# EAGLE board relay_matrix_16x8 (EAGLE 9.5.1), part 1 of 2
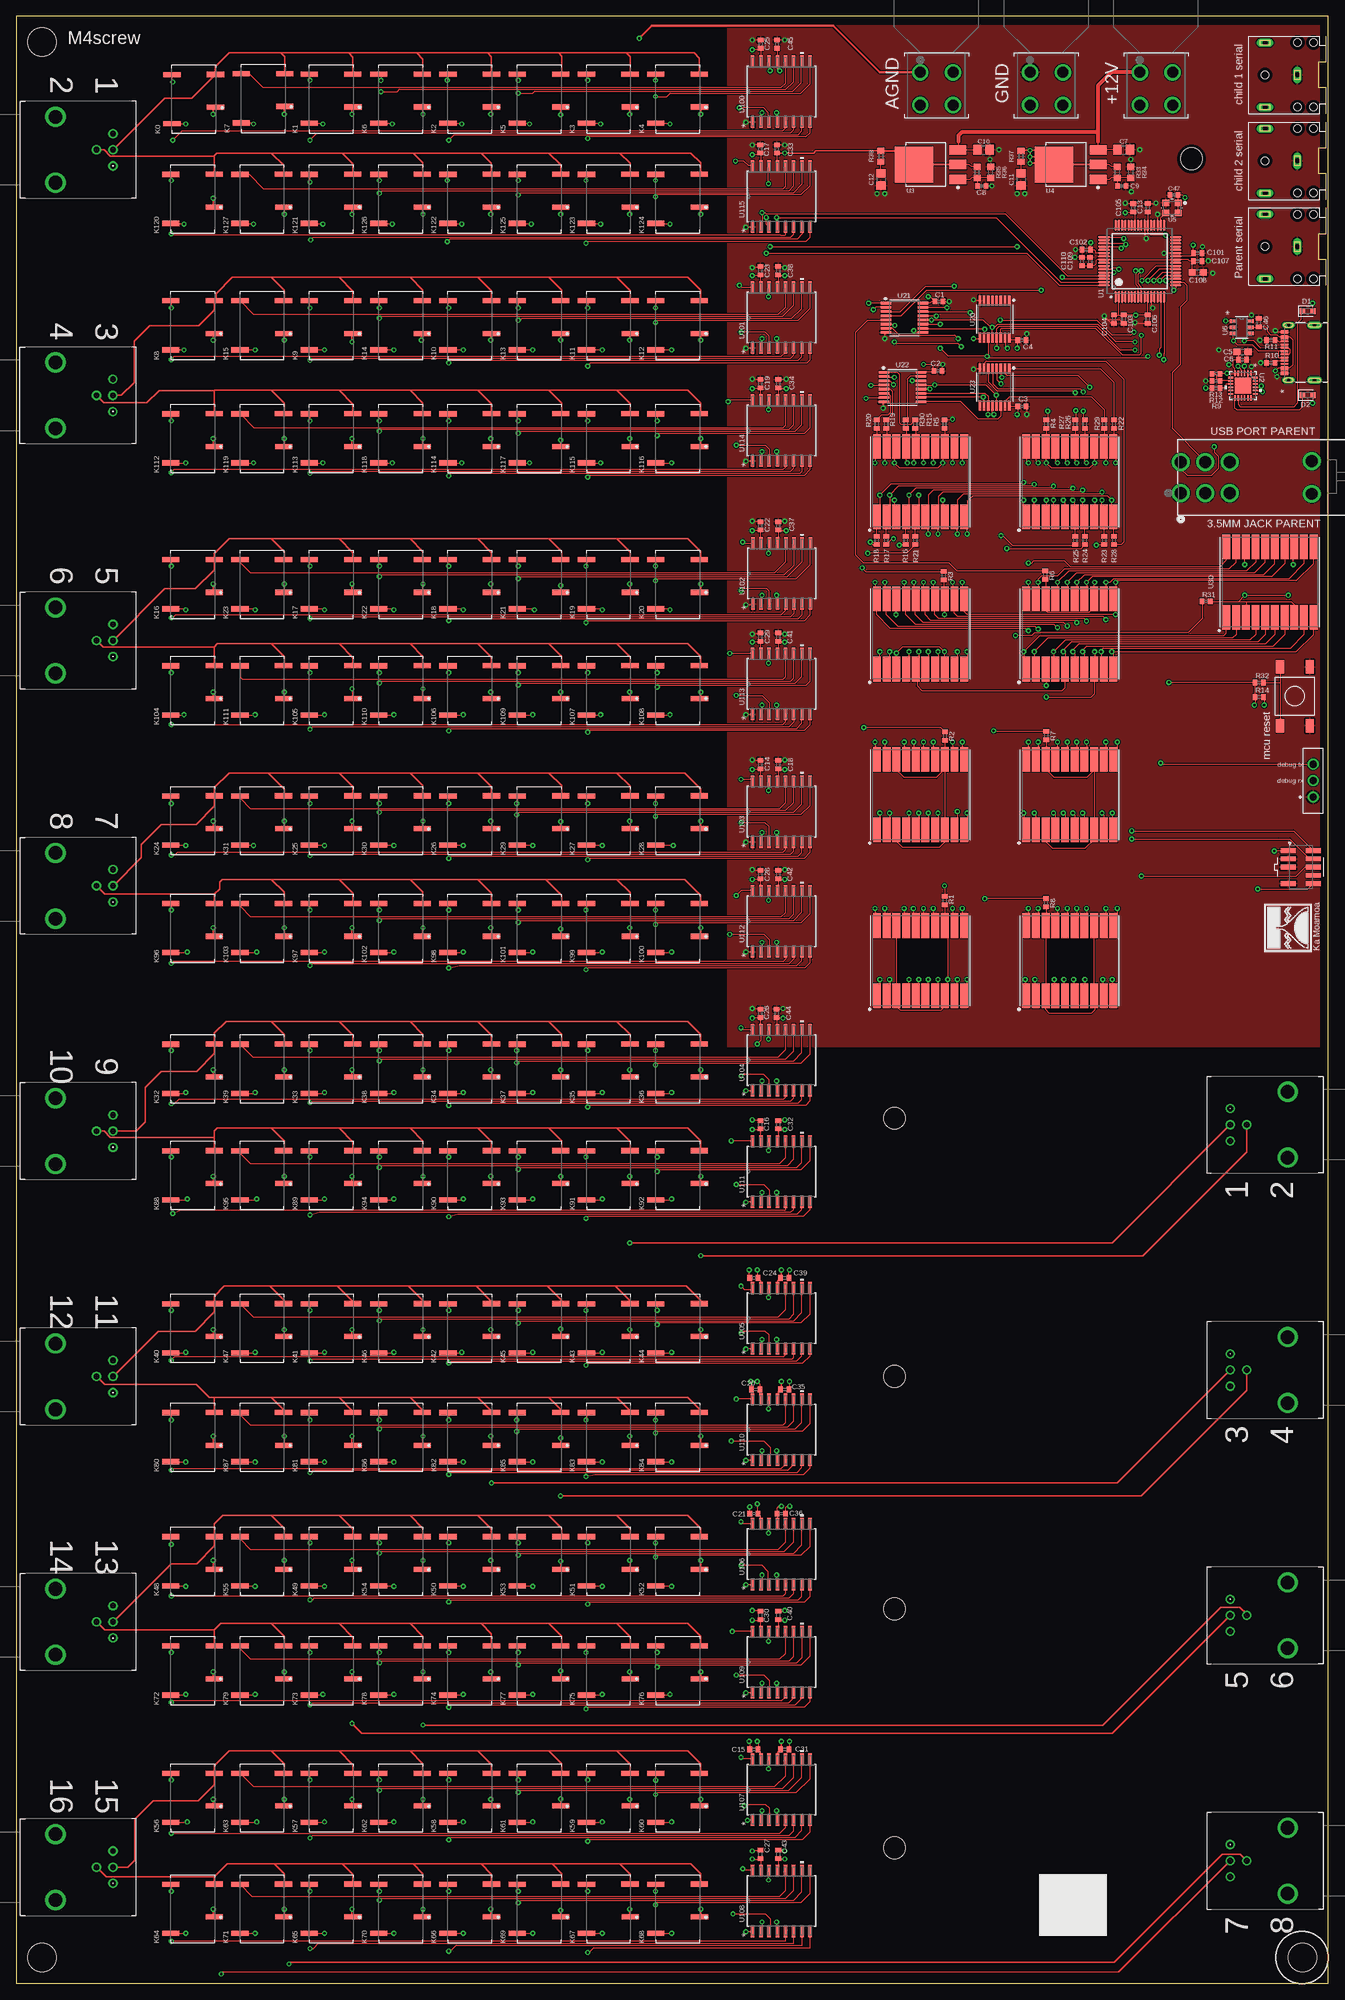
[diagram p7: board, top side]
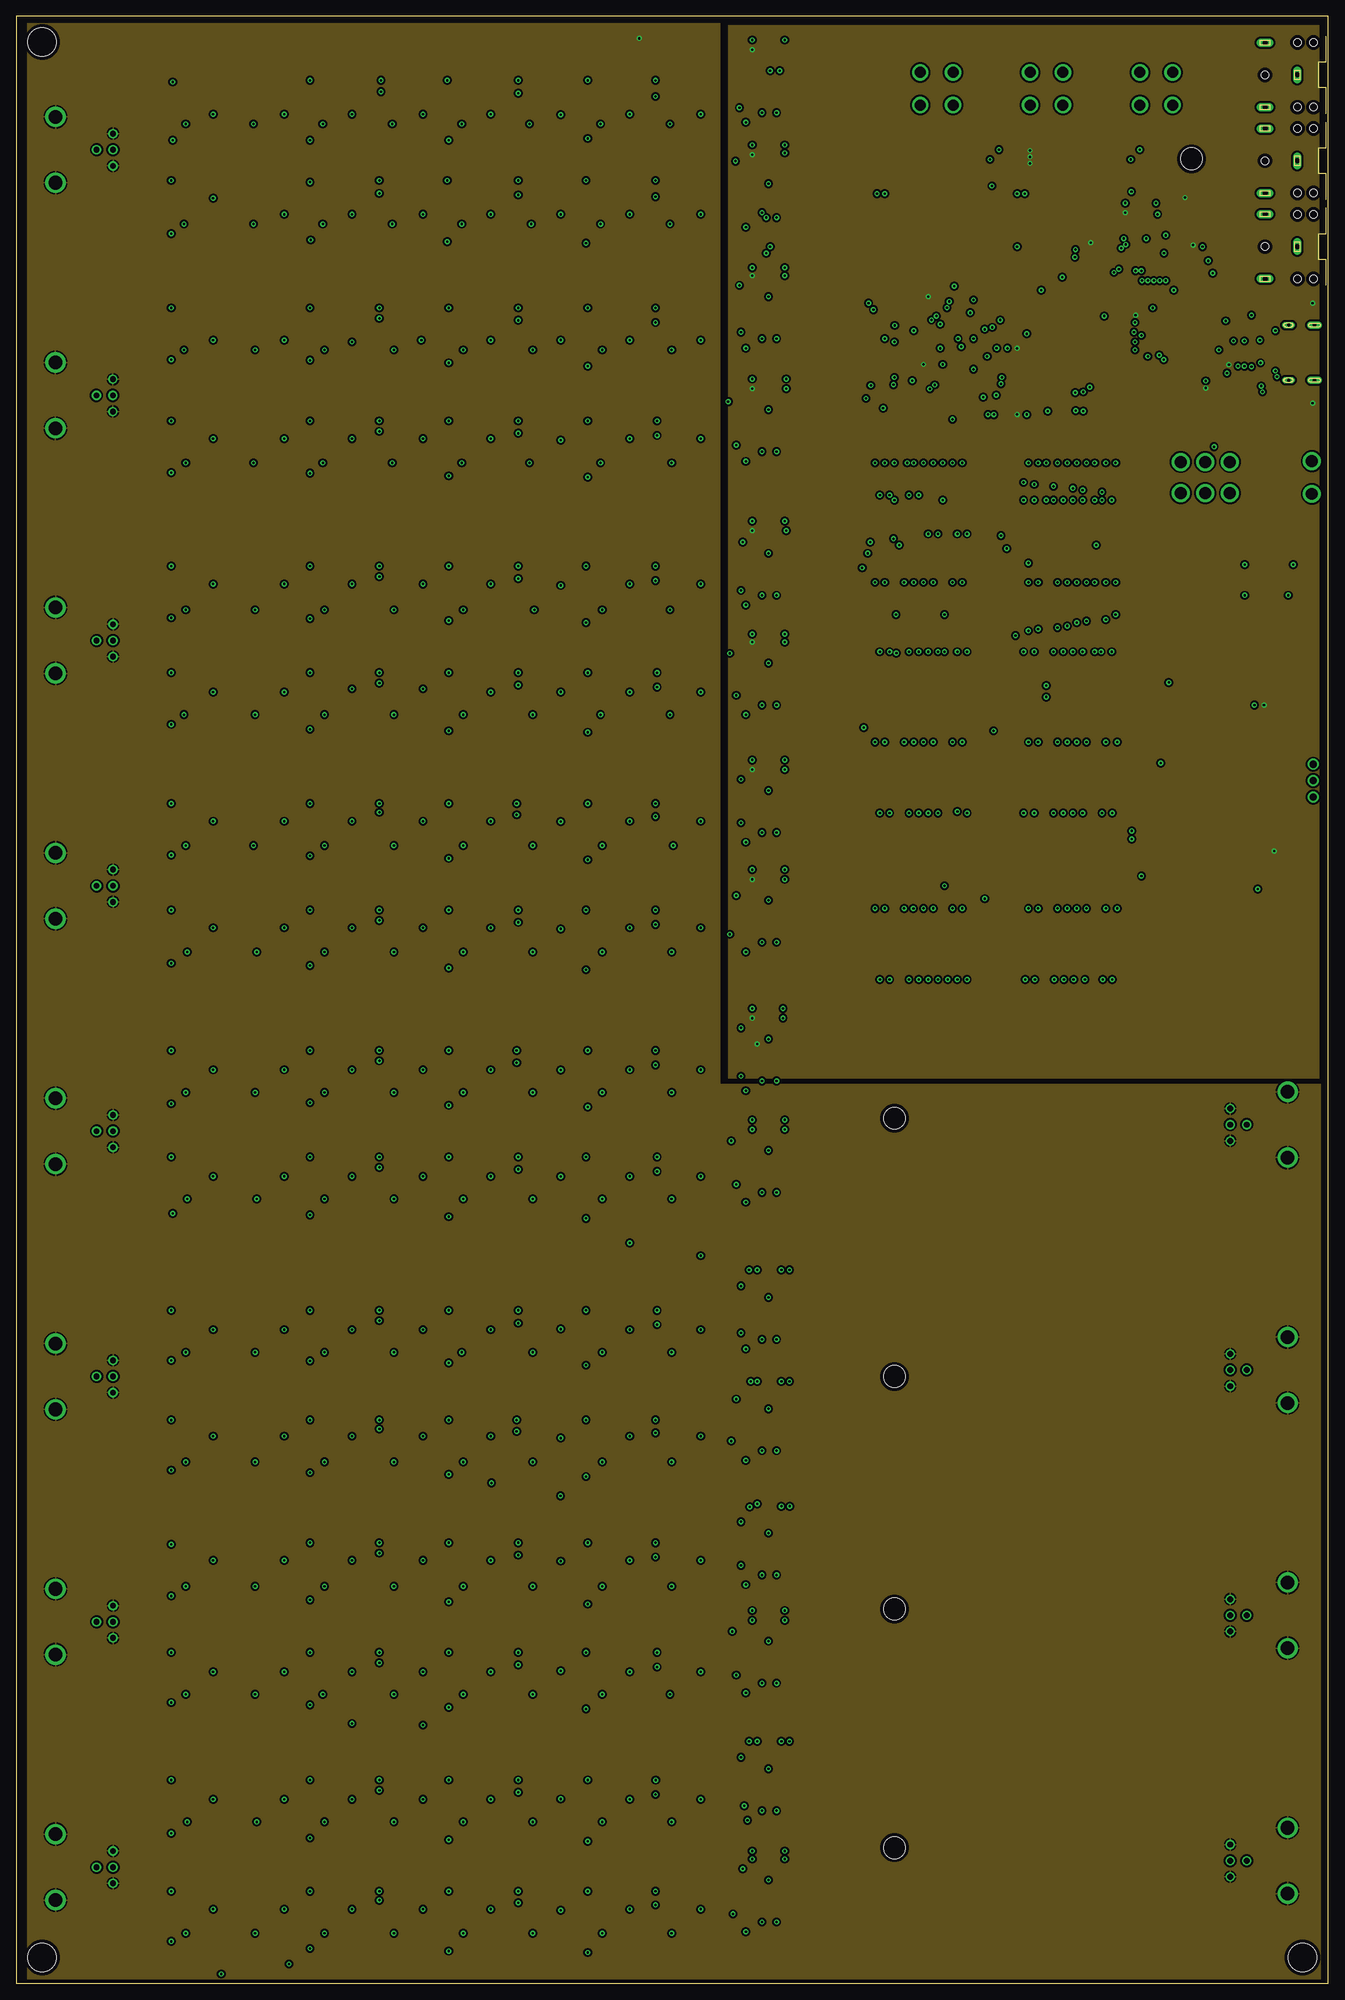
[diagram p8: board, inner layer Route2]
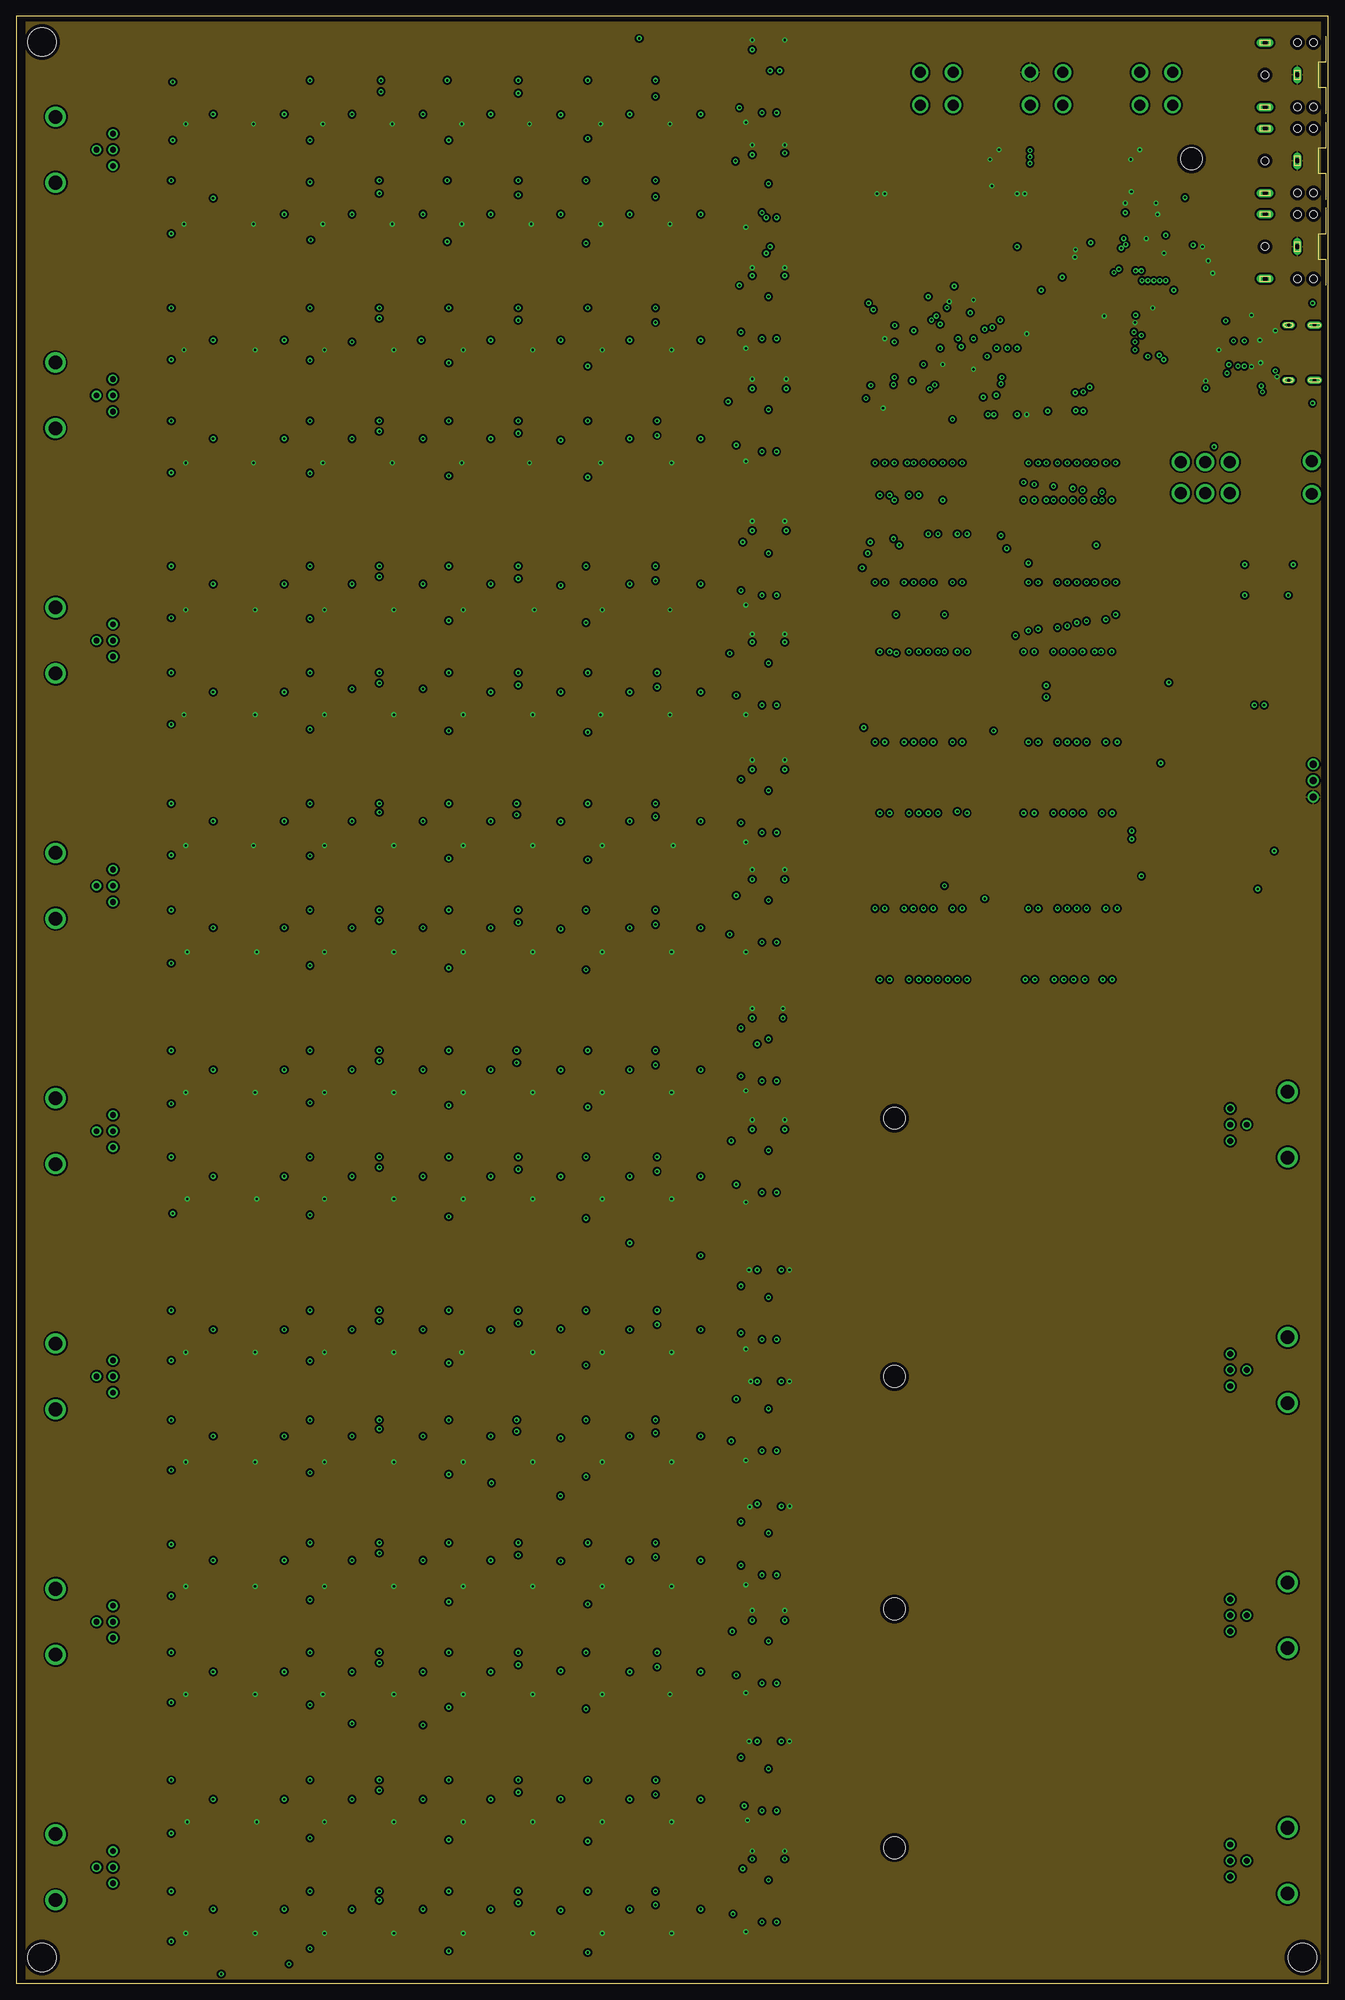
[diagram p9: board, inner layer Route15]
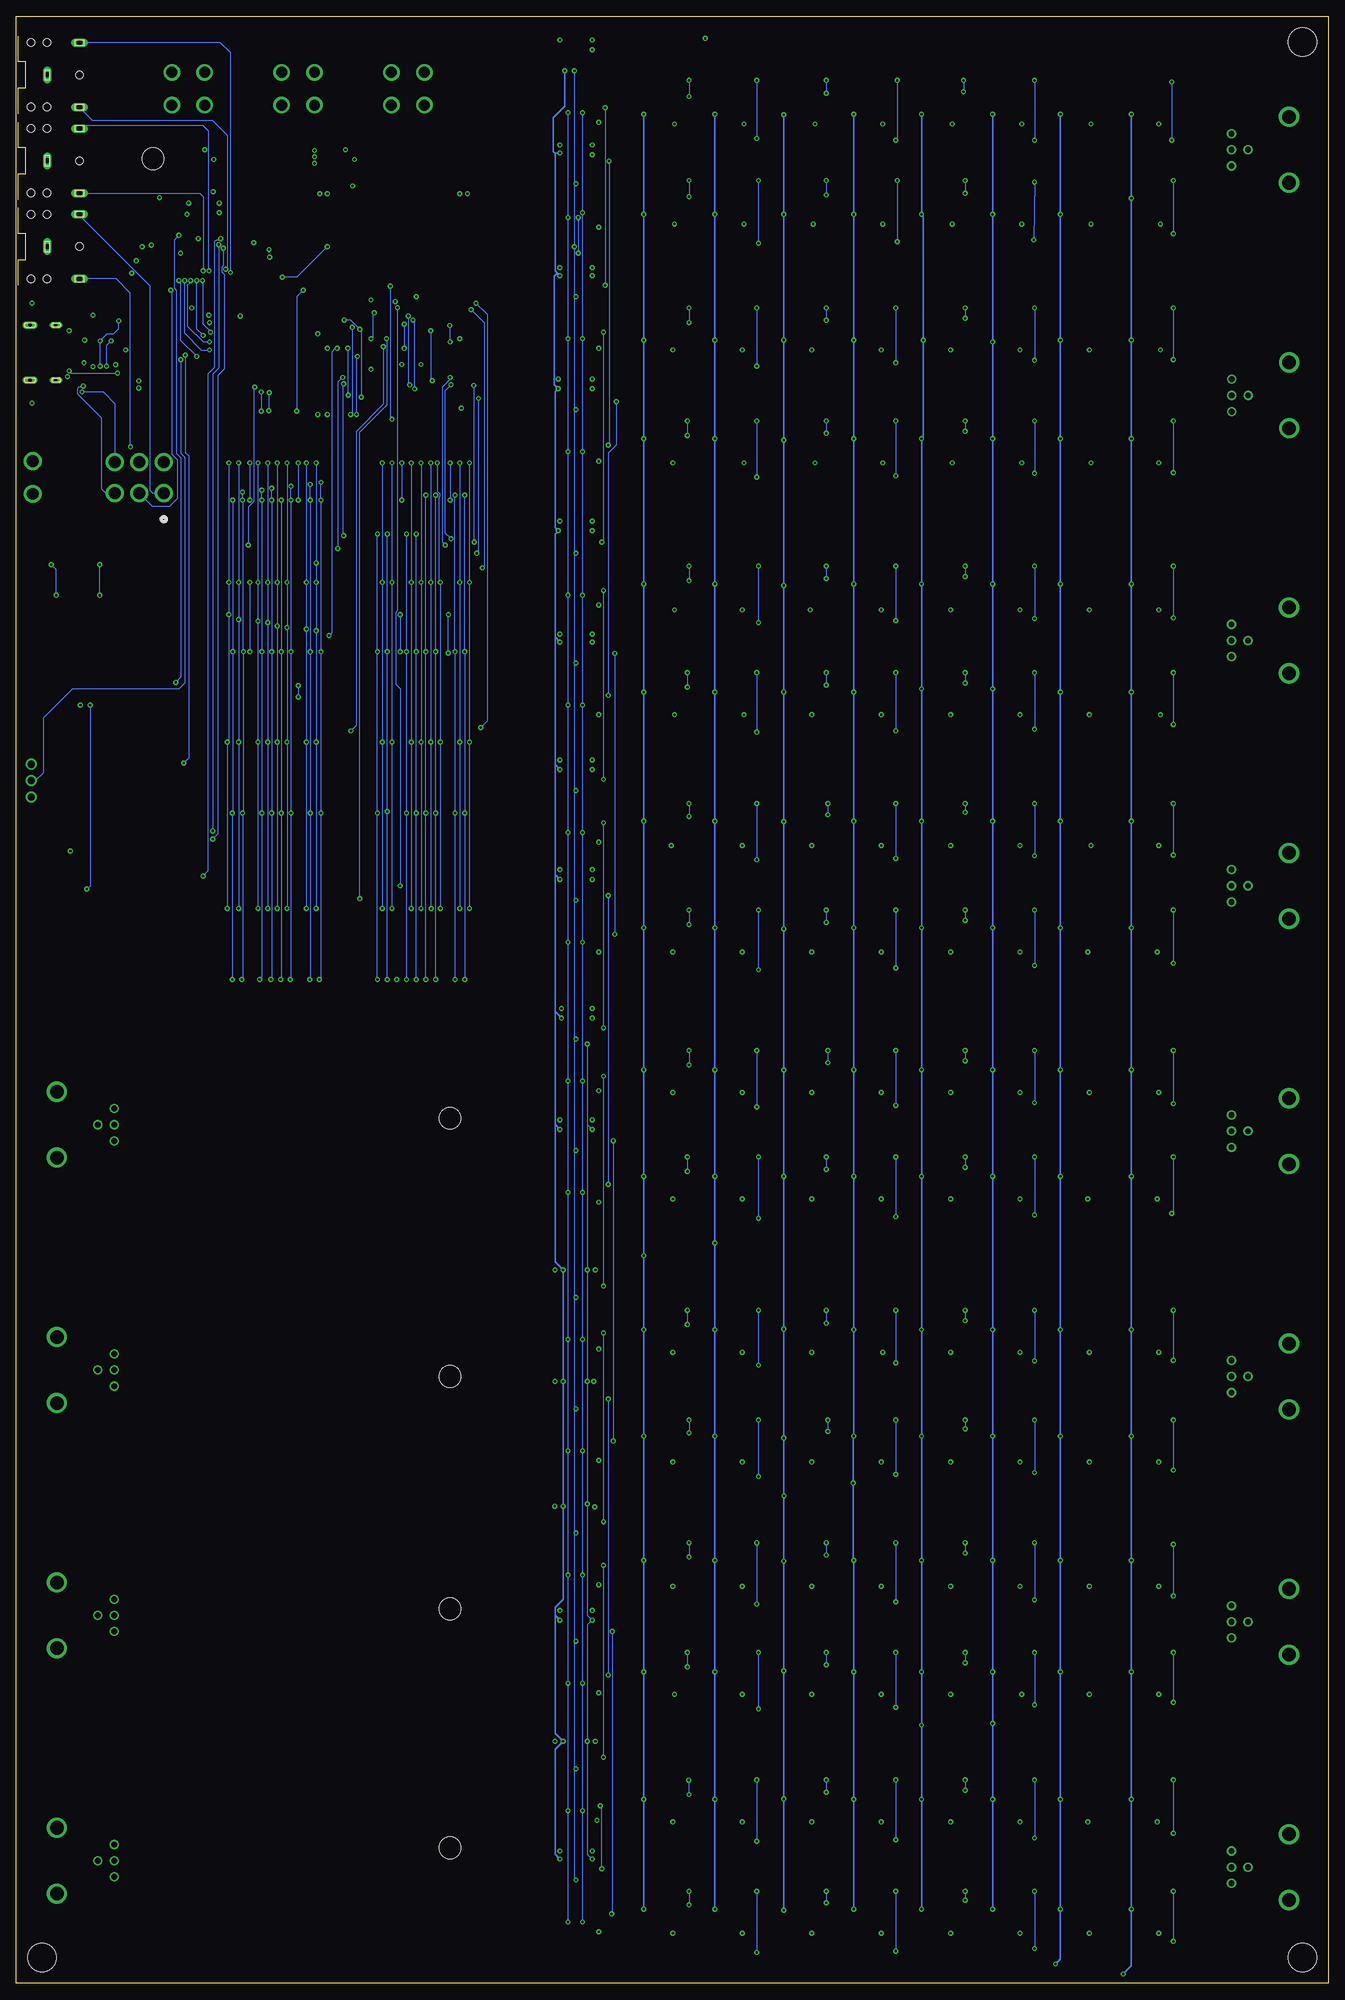
[diagram p10: board, bottom side, seen from below]

Size 203.2 x 304.7 mm. Coordinates in mm from the lower left corner, seen from the top.
Outline: 0,0 203.2,0 203.2,304.7 0,304.7 0,0
Copper layers (1+2*15+16): Top 0.035mm / dielectric 1.5mm / Route2 0.035mm / dielectric 0.15mm / Route15 0.035mm / dielectric 0.2mm / Bottom 0.035mm
Design rules "default *": minimum track width 6mil, minimum drill 0.35mm, track to track 6mil, track to pad 6mil, pad to pad 6mil, via to via 6mil, smd to smd 6mil, copper to edge 20mil, drill to drill 6mil, minimum pad ring 10mil, minimum via ring 8mil, stop-mask expansion 4mil, vias tented up to drill 0mil, thermal gap 10mil
Holes 4.5 mm at 199.2,4 4,4 4,300.7
Holes 3.4 mm at 136,21 136,58 136,94 136,134 182,282.6

## Footprints (pad centres in the part's own frame; a part is rotated, then mirrored left to right if it is on the bottom)
C0402 = smd 0.7 x 0.9: 1 -0.65,0; 2 0.65,0
C0603 = smd 1.1 x 1: 1 -0.85,0; 2 0.85,0
C0805 = smd 1.3 x 1.5: 1 -0.95,0; 2 0.95,0
DIOC1608X70N = smd 0.871 x 0.97: 1 -0.8,0; 2 0.8,0
CONN_CT3151 = drill 1.702 pad 2.21: 1 0,0; 2 5.08,0; 3 0,-5.08; 4 5.08,-5.08
G6L-1F-DC4.5 = smd 0.8 x 2.66: 2 2.54,-6.75; 4 7.62,-6.74; 5 7.6,0; 8 0,0
R0402 = smd 0.7 x 0.9: 1 -0.65,0; 2 0.65,0
R0603 = smd 1 x 1.1: 1 -0.85,0; 2 0.85,0
100DP1T2B4M7QE_EWI = drill 1.854 pad 2.362: 1 0,0; 2 0,-3.81; 3 0,-7.62; 4 4.826,0; 5 4.826,-3.81; 6 4.826,-7.62; 7 -0.127,-20.32; 8 4.953,-20.32
TE_FSMJSMA = smd 1.3 x 2.1: P$1 -2.3,4.55; P$2 -2.3,-4.55; P$3 2.3,4.55; P$4 2.3,-4.55
PM0064A_N = smd 1.8 x 0.3: 1 -5.55,3.75; 2 -5.55,3.25; 3 -5.55,2.75; 4 -5.55,2.25; 5 -5.55,1.75; 6 -5.55,1.25; 7 -5.55,0.75; 8 -5.55,0.25; 9 -5.55,-0.25; 10 -5.55,-0.75; 11 -5.55,-1.25; 12 -5.55,-1.75; 13 -5.55,-2.25; 14 -5.55,-2.75; 15 -5.55,-3.25; 16 -5.55,-3.75; 33 5.55,-3.75; 34 5.55,-3.25; 35 5.55,-2.75; 36 5.55,-2.25; 37 5.55,-1.75; 38 5.55,-1.25; 39 5.55,-0.75; 40 5.55,-0.25; 41 5.55,0.25; 42 5.55,0.75; 43 5.55,1.25; 44 5.55,1.75; 45 5.55,2.25; 46 5.55,2.75; 47 5.55,3.25; 48 5.55,3.75 | smd 0.3 x 1.8: 17 -3.75,-5.55; 18 -3.25,-5.55; 19 -2.75,-5.55; 20 -2.25,-5.55; 21 -1.75,-5.55; 22 -1.25,-5.55; 23 -0.75,-5.55; 24 -0.25,-5.55; 25 0.25,-5.55; 26 0.75,-5.55; 27 1.25,-5.55; 28 1.75,-5.55; 29 2.25,-5.55; 30 2.75,-5.55; 31 3.25,-5.55; 32 3.75,-5.55; 49 3.75,5.55; 50 3.25,5.55; 51 2.75,5.55; 52 2.25,5.55; 53 1.75,5.55; 54 1.25,5.55; 55 0.75,5.55; 56 0.25,5.55; 57 -0.25,5.55; 58 -0.75,5.55; 59 -1.25,5.55; 60 -1.75,5.55; 61 -2.25,5.55; 62 -2.75,5.55; 63 -3.25,5.55; 64 -3.75,5.55
QFN24_SIL = smd 0.813 x 0.254: 1 -1.892,1.25; 2 -1.892,0.75; 3 -1.892,0.25; 4 -1.892,-0.25; 5 -1.892,-0.75; 6 -1.892,-1.25; 13 1.892,-1.25; 14 1.892,-0.75; 15 1.892,-0.25; 16 1.892,0.25; 17 1.892,0.75; 18 1.892,1.25 | smd 0.254 x 0.813: 7 -1.25,-1.892; 8 -0.75,-1.892; 9 -0.25,-1.892; 10 0.25,-1.892; 11 0.75,-1.892; 12 1.25,-1.892; 19 1.25,1.892; 20 0.75,1.892; 21 0.25,1.892; 22 -0.25,1.892; 23 -0.75,1.892; 24 -1.25,1.892 | smd 2.54 x 2.54: 25 0,0
TO230P990X240-4N = smd 2.634 x 1.489: 1 -4.241,2.3; 2 -4.241,0; 3 -4.241,-2.3 | smd 5.934 x 5.527: 4 2.591,0
OSCCC250X200X110N = smd 1.081 x 0.981: 1 -0.966,-0.765; 2 0.966,-0.765; 3 0.966,0.765; 4 -0.966,0.765
DBV6 = smd 0.972 x 0.558: 1 -1.362,0.95; 2 -1.362,0; 3 -1.362,-0.95; 4 1.362,-0.95; 5 1.362,0; 6 1.362,0.95
SOP65P640X120-16N = smd 1.572 x 0.407: 1 -2.872,2.275; 2 -2.872,1.625; 3 -2.872,0.975; 4 -2.872,0.325; 5 -2.872,-0.325; 6 -2.872,-0.975; 7 -2.872,-1.625; 8 -2.872,-2.275; 9 2.872,-2.275; 10 2.872,-1.625; 11 2.872,-0.975; 12 2.872,-0.325; 13 2.872,0.325; 14 2.872,0.975; 15 2.872,1.625; 16 2.872,2.275
LDD-SMHTA304RISITR-20DFN = smd 3.812 x 1.232: 1 -5.45,6.75; 2 -5.45,5.25; 3 -5.45,3.75; 4 -5.45,2.25; 5 -5.45,0.75; 6 -5.45,-0.75; 7 -5.45,-2.25; 8 -5.45,-3.75; 9 -5.45,-5.25; 10 -5.45,-6.75; 11 5.45,-6.75; 12 5.45,-5.25; 13 5.45,-3.75; 14 5.45,-2.25; 15 5.45,-0.75; 16 5.45,0.75; 17 5.45,2.25; 18 5.45,3.75; 19 5.45,5.25; 20 5.45,6.75
SOIC-16_WM_MCH = smd 1.727 x 0.533: 1 -4.75,4.445; 2 -4.75,3.175; 3 -4.75,1.905; 4 -4.75,0.635; 5 -4.75,-0.635; 6 -4.75,-1.905; 7 -4.75,-3.175; 8 -4.75,-4.445; 9 4.75,-4.445; 10 4.75,-3.175; 11 4.75,-1.905; 12 4.75,-0.635; 13 4.75,0.635; 14 4.75,1.905; 15 4.75,3.175; 16 4.75,4.445
HDRV3W64P254_1X3_1016X277X854B = drill 1.105 pad 1.705: 1 0,0; 2 2.54,0; 3 5.08,0
2171790001_MOL = smd 0.61 x 1.143: A1/B12 -3.168,3.303; A4/B9 -2.368,3.303; B1/A12 3.232,3.303; B4/A9 2.432,3.303 | smd 0.305 x 1.143: A5 -1.218,3.303; A6 -0.218,3.303; A7 0.282,3.303; A8 1.282,3.303; B5 1.782,3.303; B6 0.782,3.303; B7 -0.718,3.303; B8 -1.718,3.303 | drill 0.5 pad 1.016 long: P$1 -4.266,2.656; P$2 4.316,2.656 | drill 0.5 pad 1.15 long: P$3 4.316,-1.328; P$4 -4.266,-1.328
FTSH-105-01-F-DV-007-K-P = smd 2.3 x 0.75: P$1 1.95,-2.54; P$2 -1.95,-2.54; P$3 1.95,-1.27; P$4 -1.95,-1.27; P$5 1.95,0; P$6 -1.95,0; P$8 -1.95,1.27; P$9 1.95,2.54; P$10 -1.95,2.54
CUI_SJ1-3523NG = drill 0.8 long: 1 0,0; 2 5,-5; 3 5,5 | hole 1.2: -2.5,5; 0,5; 5,0; -2.5,-5; 0,-5
364A2595 = drill 0.9: 1 0,2.5; 2 0,0; 3 0,-2.5; 4 2.55,0 | drill 2.1: M1 8.9,5.1; M2 8.9,-5.1

## Placement (x,y rotation side)
C1  .1uF  [C0402]  142.91,260.5 0 top
C2  .1uF  [C0402]  142.75,249.75 0 top
C3  .1uF  [C0402]  155.75,244.25 0 top
C4  .1uF  [C0402]  155.75,254.5 0 top
C5  4.7uF  [C0603]  189.9,252.7 0 top
C6  .1uF  [C0402]  189.9,251.5 0 top
C7  10uF  [C0805]  171.5,284 0 top
C8  1uF  [C0402]  149.5,278.4 0 top
C9  1uF  [C0402]  171.2,278.4 0 top
C10  10uF  [C0805]  149.8,284 0 top
C11  10uF  [C0805]  155.6,279.4 270 top
C12  10uF  [C0805]  133.9,279.4 270 top
C13  0.01uF  [C0402]  175.24,275.01 90 top
C14  1uF  [C0402]  115.25,188.75 90 top
C15  1uF  [C0402]  114.25,36.25 180 top
C16  1uF  [C0402]  115.25,133 90 top
C17  1uF  [C0402]  115.24,284.13 90 top
C18  1uF  [C0402]  118,188.75 90 top
C19  1uF  [C0402]  115.25,247.75 90 top
C20  1uF  [C0402]  114.5,92 180 top
C21  1uF  [C0402]  114.25,72.75 180 top
C22  1uF  [C0402]  115.25,225.75 90 top
C23  1uF  [C0402]  115.25,265.25 90 top
C24  1uF  [C0402]  114.25,109.25 180 top
C25  1uF  [C0402]  115.3,300.38 90 top
C26  1uF  [C0402]  115.25,150.25 90 top
C27  1uF  [C0402]  115.25,20 90 top
C28  1uF  [C0402]  115.25,171.75 90 top
C29  1uF  [C0402]  115.25,208.5 90 top
C30  1uF  [C0402]  115.25,57 90 top
C31  1uF  [C0402]  119,36.25 0 top
C32  1uF  [C0402]  118,133 90 top
C33  1uF  [C0402]  117.81,284.13 90 top
C34  1uF  [C0402]  118,247.75 90 top
C35  1uF  [C0402]  119,92 0 top
C36  1uF  [C0402]  118.5,72.75 0 top
C37  1uF  [C0402]  118,225.75 90 top
C38  1uF  [C0402]  117.99,265.25 90 top
C39  1uF  [C0402]  119,109.25 0 top
C40  1uF  [C0402]  118,57 90 top
C41  1uF  [C0402]  118,208.5 90 top
C42  1uF  [C0402]  118,171.75 90 top
C43  1uF  [C0402]  118,20 90 top
C44  1uF  [C0402]  117.75,150.25 90 top
C45  1uF  [C0402]  117.83,300.38 90 top
C46  0.1uF  [C0402]  192.4,257.2 90 top
C47  100n  [C0402]  179.3,277 180 top
C101  0.1uF  [C0402]  183,268 0 top
C102  0.1uF  [C0402]  165.7,268.55 180 top
C103  0.01uF  [C0402]  171.5,257.75 270 top
C104  0.01uF  [C0402]  170,257.75 270 top
C105  1uF  [C0402]  173,275 90 top
C106  0.1uF  [C0402]  175.25,257.75 270 top
C107  0.1uF  [C0402]  183,266.75 0 top
C108  2.2uF  [C0603]  183,265 0 top
C109  0.1uF  [C0402]  166.3,266.7 90 top
C110  1uF  [C0402]  165.05,266.7 90 top
D1  XZCBD53W-8  [DIOC1608X70N]  200,259 0 top
D2  XZCBD53W-8  [DIOC1608X70N]  200,246 0 top
J6  CT3151  [CONN_CT3151]  157,296 0 top
J7  CT3151  [CONN_CT3151]  174,296 0 top
J8  CT3151  [CONN_CT3151]  140,296 0 top
K0  [G6L-1F-DC4.5]  24.13,288.04 90 top
K1  [G6L-1F-DC4.5]  45.4,288.1 90 top
K2  [G6L-1F-DC4.5]  66.87,288.1 90 top
K3  [G6L-1F-DC4.5]  88.33,288.1 90 top
K4  [G6L-1F-DC4.5]  99.06,288.1 90 top
K5  [G6L-1F-DC4.5]  77.6,288.1 90 top
K6  [G6L-1F-DC4.5]  56.13,288.1 90 top
K7  [G6L-1F-DC4.5]  34.86,288.16 90 top
K8  [G6L-1F-DC4.5]  23.94,253 90 top
K9  [G6L-1F-DC4.5]  45.4,253 90 top
K10  [G6L-1F-DC4.5]  66.87,253 90 top
K11  [G6L-1F-DC4.5]  88.33,253 90 top
K12  [G6L-1F-DC4.5]  99.06,253 90 top
K13  [G6L-1F-DC4.5]  77.6,253 90 top
K14  [G6L-1F-DC4.5]  56.13,253 90 top
K15  [G6L-1F-DC4.5]  34.67,253 90 top
K16  [G6L-1F-DC4.5]  23.94,212.9 90 top
K17  [G6L-1F-DC4.5]  45.4,212.9 90 top
K18  [G6L-1F-DC4.5]  66.87,212.9 90 top
K19  [G6L-1F-DC4.5]  88.33,212.9 90 top
K20  [G6L-1F-DC4.5]  99.06,212.9 90 top
K21  [G6L-1F-DC4.5]  77.6,212.9 90 top
K22  [G6L-1F-DC4.5]  56.13,212.9 90 top
K23  [G6L-1F-DC4.5]  34.67,212.9 90 top
K24  [G6L-1F-DC4.5]  23.94,176.31 90 top
K25  [G6L-1F-DC4.5]  45.4,176.31 90 top
K26  [G6L-1F-DC4.5]  66.87,176.31 90 top
K27  [G6L-1F-DC4.5]  88.33,176.31 90 top
K28  [G6L-1F-DC4.5]  99.06,176.31 90 top
K29  [G6L-1F-DC4.5]  77.6,176.31 90 top
K30  [G6L-1F-DC4.5]  56.13,176.31 90 top
K31  [G6L-1F-DC4.5]  34.67,176.31 90 top
K32  [G6L-1F-DC4.5]  23.94,137.86 90 top
K33  [G6L-1F-DC4.5]  45.4,137.86 90 top
K34  [G6L-1F-DC4.5]  66.87,137.86 90 top
K35  [G6L-1F-DC4.5]  88.33,137.86 90 top
K36  [G6L-1F-DC4.5]  99.06,137.86 90 top
K37  [G6L-1F-DC4.5]  77.6,137.86 90 top
K38  [G6L-1F-DC4.5]  56.13,137.86 90 top
K39  [G6L-1F-DC4.5]  34.67,137.86 90 top
K40  [G6L-1F-DC4.5]  23.94,97.66 90 top
K41  [G6L-1F-DC4.5]  45.4,97.66 90 top
K42  [G6L-1F-DC4.5]  66.87,97.66 90 top
K43  [G6L-1F-DC4.5]  88.33,97.66 90 top
K44  [G6L-1F-DC4.5]  99.06,97.66 90 top
K45  [G6L-1F-DC4.5]  77.6,97.66 90 top
K46  [G6L-1F-DC4.5]  56.13,97.66 90 top
K47  [G6L-1F-DC4.5]  34.67,97.66 90 top
K48  [G6L-1F-DC4.5]  23.94,61.59 90 top
K49  [G6L-1F-DC4.5]  45.4,61.59 90 top
K50  [G6L-1F-DC4.5]  66.87,61.59 90 top
K51  [G6L-1F-DC4.5]  88.33,61.59 90 top
K52  [G6L-1F-DC4.5]  99.06,61.59 90 top
K53  [G6L-1F-DC4.5]  77.6,61.59 90 top
K54  [G6L-1F-DC4.5]  56.13,61.59 90 top
K55  [G6L-1F-DC4.5]  34.67,61.59 90 top
K56  [G6L-1F-DC4.5]  23.94,24.94 90 top
K57  [G6L-1F-DC4.5]  45.4,24.94 90 top
K58  [G6L-1F-DC4.5]  66.87,24.94 90 top
K59  [G6L-1F-DC4.5]  88.33,24.94 90 top
K60  [G6L-1F-DC4.5]  99.06,24.94 90 top
K61  [G6L-1F-DC4.5]  77.6,24.94 90 top
K62  [G6L-1F-DC4.5]  56.13,24.94 90 top
K63  [G6L-1F-DC4.5]  34.67,24.94 90 top
K64  [G6L-1F-DC4.5]  23.94,7.75 90 top
K65  [G6L-1F-DC4.5]  45.4,7.75 90 top
K66  [G6L-1F-DC4.5]  66.87,7.75 90 top
K67  [G6L-1F-DC4.5]  88.33,7.75 90 top
K68  [G6L-1F-DC4.5]  99.06,7.75 90 top
K69  [G6L-1F-DC4.5]  77.6,7.75 90 top
K70  [G6L-1F-DC4.5]  56.13,7.75 90 top
K71  [G6L-1F-DC4.5]  34.67,7.75 90 top
K72  [G6L-1F-DC4.5]  23.94,44.65 90 top
K73  [G6L-1F-DC4.5]  45.4,44.65 90 top
K74  [G6L-1F-DC4.5]  66.87,44.65 90 top
K75  [G6L-1F-DC4.5]  88.33,44.65 90 top
K76  [G6L-1F-DC4.5]  99.06,44.65 90 top
K77  [G6L-1F-DC4.5]  77.6,44.65 90 top
K78  [G6L-1F-DC4.5]  56.13,44.65 90 top
K79  [G6L-1F-DC4.5]  34.67,44.65 90 top
K80  [G6L-1F-DC4.5]  23.94,80.8 90 top
K81  [G6L-1F-DC4.5]  45.4,80.8 90 top
K82  [G6L-1F-DC4.5]  66.87,80.8 90 top
K83  [G6L-1F-DC4.5]  88.33,80.8 90 top
K84  [G6L-1F-DC4.5]  99.06,80.8 90 top
K85  [G6L-1F-DC4.5]  77.6,80.8 90 top
K86  [G6L-1F-DC4.5]  56.13,80.8 90 top
K87  [G6L-1F-DC4.5]  34.67,80.8 90 top
K88  [G6L-1F-DC4.5]  23.94,121.35 90 top
K89  [G6L-1F-DC4.5]  45.4,121.35 90 top
K90  [G6L-1F-DC4.5]  66.87,121.35 90 top
K91  [G6L-1F-DC4.5]  88.33,121.35 90 top
K92  [G6L-1F-DC4.5]  99.06,121.35 90 top
K93  [G6L-1F-DC4.5]  77.6,121.35 90 top
K94  [G6L-1F-DC4.5]  56.13,121.35 90 top
K95  [G6L-1F-DC4.5]  34.67,121.35 90 top
K96  [G6L-1F-DC4.5]  23.94,159.65 90 top
K97  [G6L-1F-DC4.5]  45.4,159.65 90 top
K98  [G6L-1F-DC4.5]  66.87,159.65 90 top
K99  [G6L-1F-DC4.5]  88.33,159.65 90 top
K100  [G6L-1F-DC4.5]  99.06,159.65 90 top
K101  [G6L-1F-DC4.5]  77.6,159.65 90 top
K102  [G6L-1F-DC4.5]  56.13,159.65 90 top
K103  [G6L-1F-DC4.5]  34.67,159.65 90 top
K104  [G6L-1F-DC4.5]  23.94,196.47 90 top
K105  [G6L-1F-DC4.5]  45.4,196.47 90 top
K106  [G6L-1F-DC4.5]  66.87,196.47 90 top
K107  [G6L-1F-DC4.5]  88.33,196.47 90 top
K108  [G6L-1F-DC4.5]  99.06,196.47 90 top
K109  [G6L-1F-DC4.5]  77.6,196.47 90 top
K110  [G6L-1F-DC4.5]  56.13,196.47 90 top
K111  [G6L-1F-DC4.5]  34.67,196.47 90 top
K112  [G6L-1F-DC4.5]  23.94,235.49 90 top
K113  [G6L-1F-DC4.5]  45.4,235.49 90 top
K114  [G6L-1F-DC4.5]  66.87,235.49 90 top
K115  [G6L-1F-DC4.5]  88.33,235.49 90 top
K116  [G6L-1F-DC4.5]  99.06,235.49 90 top
K117  [G6L-1F-DC4.5]  77.6,235.49 90 top
K118  [G6L-1F-DC4.5]  56.13,235.49 90 top
K119  [G6L-1F-DC4.5]  34.67,235.49 90 top
K120  [G6L-1F-DC4.5]  23.94,272.59 90 top
K121  [G6L-1F-DC4.5]  45.4,272.59 90 top
K122  [G6L-1F-DC4.5]  66.87,272.59 90 top
K123  [G6L-1F-DC4.5]  88.33,272.59 90 top
K124  [G6L-1F-DC4.5]  99.06,272.59 90 top
K125  [G6L-1F-DC4.5]  77.6,272.59 90 top
K126  [G6L-1F-DC4.5]  56.13,272.59 90 top
K127  [G6L-1F-DC4.5]  34.67,272.59 90 top
R1  [R0402]  143.78,167.7 270 top
R2  [R0402]  143.83,193.21 270 top
R3  [R0402]  143.65,218.04 270 top
R4  [R0402]  159.5,241.5 270 top
R5  [R0402]  143.75,241.5 270 top
R6  [R0402]  159.35,218.11 270 top
R7  [R0402]  159.53,193.27 270 top
R8  [R0402]  159.48,167.38 270 top
R9  1k  [R0402]  185.8,247.1 0 top
R10  5.1k  [R0402]  194.25,251 0 top
R11  5.1k  [R0402]  194.25,254.5 0 top
R12  47.5k  [R0402]  185.8,248.2 0 top
R13  22.1k  [R0402]  185.8,249.3 0 top
R14  10kohm  [R0402]  192.5,199.25 0 top
R15  [R0402]  139.25,241.5 90 top
R16  [R0402]  137.75,223.5 270 top
R17  [R0402]  134.75,223.5 270 top
R18  [R0402]  133.25,223.5 270 top
R19  [R0402]  134.75,241.5 90 top
R20  [R0402]  133.25,241.5 90 top
R21  [R0402]  139.25,223.5 270 top
R22  [R0402]  170,241.5 90 top
R23  [R0402]  168.5,223.5 270 top
R24  [R0402]  165.5,223.5 270 top
R25  [R0402]  164,223.5 270 top
R26  [R0402]  165.5,241.5 90 top
R27  [R0402]  164,241.5 90 top
R28  [R0402]  170,223.5 270 top
R29  [R0402]  168.5,241.5 270 top
R30  [R0402]  137.75,241.5 270 top
R31  [R0402]  184.26,214.05 0 top
R32  470ohm  [R0402]  192.5,201.5 0 top
R33  220  [R0603]  170.5,280.5 90 top
R34  360  [R0603]  172.6,280.5 270 top
R35  220  [R0603]  148.8,280.5 90 top
R36  680  [R0603]  150.9,280.5 270 top
R37  1  [R0603]  155.6,283 90 top
R38  1  [R0603]  133.9,283 90 top
S1  100DP1T2B4M7QE  [100DP1T2B4M7QE_EWI]  180.34,230.83 90 top
S2  [TE_FSMJSMA]  198.01,199.36 0 top
U1  TM4C123GH6PMI  [PM0064A_N]  174,266.75 90 top
U2  CP2102N-A02-GQFN24R  [QFN24_SIL]  189.99,247.47 270 top
U3  NCP1117XXA  [TO230P990X240-4N]  141.6,281.7 180 top
U4  NCP1117XXA  [TO230P990X240-4N]  163.3,281.7 180 top
U5  ECS-2033-080-AU  [OSCCC250X200X110N]  179,275 180 top
U6  [DBV6]  189.8,256.5 0 top
U20  SN74HCS595  [SOP65P640X120-16N]  151.5,257.75 270 top
U21  SN74HCS595  [SOP65P640X120-16N]  137.56,257.96 0 top
U22  SN74HCS595  [SOP65P640X120-16N]  137.25,247.25 0 top
U23  SN74HCS595  [SOP65P640X120-16N]  151.5,247.25 270 top
U30  LDD-SMHTA304RISITR  [LDD-SMHTA304RISITR-20DFN]  194.17,217.04 90 top
U31  LDD-SMHTA304RISITR  [LDD-SMHTA304RISITR-20DFN]  140.05,158.4 90 top
U32  LDD-SMHTA304RISITR  [LDD-SMHTA304RISITR-20DFN]  140.05,184.12 90 top
U33  LDD-SMHTA304RISITR  [LDD-SMHTA304RISITR-20DFN]  140.05,209.02 90 top
U34  LDD-SMHTA304RISITR  [LDD-SMHTA304RISITR-20DFN]  140.05,232.59 90 top
U35  LDD-SMHTA304RISITR  [LDD-SMHTA304RISITR-20DFN]  163.17,232.59 90 top
U36  LDD-SMHTA304RISITR  [LDD-SMHTA304RISITR-20DFN]  163.17,209.02 90 top
U37  LDD-SMHTA304RISITR  [LDD-SMHTA304RISITR-20DFN]  163.17,184.12 90 top
U38  LDD-SMHTA304RISITR  [LDD-SMHTA304RISITR-20DFN]  163.17,158.4 90 top
U100  [SOIC-16_WM_MCH]  118.5,293 90 top
U101  [SOIC-16_WM_MCH]  118.5,258 90 top
U102  [SOIC-16_WM_MCH]  118.55,218.36 90 top
U103  [SOIC-16_WM_MCH]  118.5,181.5 90 top
U104  [SOIC-16_WM_MCH]  118.5,143 90 top
U105  [SOIC-16_WM_MCH]  118.5,103 90 top
U106  [SOIC-16_WM_MCH]  118.5,66.5 90 top
U107  [SOIC-16_WM_MCH]  118.5,30 90 top
U108  [SOIC-16_WM_MCH]  118.5,12.75 90 top
U109  [SOIC-16_WM_MCH]  118.5,49.75 90 top
U110  [SOIC-16_WM_MCH]  118.5,85.75 90 top
U111  [SOIC-16_WM_MCH]  118.5,125.75 90 top
U112  [SOIC-16_WM_MCH]  118.5,164.5 90 top
U113  [SOIC-16_WM_MCH]  118.5,201.25 90 top
U114  [SOIC-16_WM_MCH]  118.5,240.5 90 top
U115  [SOIC-16_WM_MCH]  118.5,276.75 90 top
U$131  3PIN_UART_HEADER  [HDRV3W64P254_1X3_1016X277X854B]  200.84,183.74 90 top
X1  2171790001  [2171790001_MOL]  199.71,252.55 90 top
X2  FTSH-105-01-F-DV-007-K-P  [FTSH-105-01-F-DV-007-K-P]  198.92,172.9 180 top
X3  SJ1-3523NG  [CUI_SJ1-3523NG]  198.4,269 180 top
X4  SJ1-3523NG  [CUI_SJ1-3523NG]  198.4,295.6 180 top
X5  SJ1-3523NG  [CUI_SJ1-3523NG]  198.4,282.3 180 top
X101  364A2595  [364A2595]  15,284 180 top
X102  364A2595  [364A2595]  14.99,245.96 180 top
X103  364A2595  [364A2595]  15,208 180 top
X104  364A2595  [364A2595]  15,170 180 top
X105  364A2595  [364A2595]  15,132 180 top
X106  364A2595  [364A2595]  15,94 180 top
X107  364A2595  [364A2595]  15,56 180 top
X108  364A2595  [364A2595]  15,18 180 top
X111  364A2595  [364A2595]  188,19 0 top
X112  364A2595  [364A2595]  188,57 0 top
X113  364A2595  [364A2595]  188,95 0 top
X114  364A2595  [364A2595]  188,133 0 top

## Tracks (layer width: path | path; a pad name or v marks a point on that pad's centre or on a via)
!RST  (via drill 0.35)
  Top 0.152: 175.25,274.35 C13.1 175.24,272.31 U1.38 175.25,271.2 175.7,270.75 v178,270.75 | v191.75,198 191.85,198.1 R14.1 R32.1 v178.5,201.5 | v192.25,169.5 200.01,169.5 X2.P$10
  Bottom 0.152: v178,270.75 178.75,270 178.75,262.61 178.4,262.26 178.4,237 177.7,236.3 177.7,202.3 v178.5,201.5 | v191.75,198 191.75,170 v192.25,169.5
+5V  (via drill 0.35)
  Top 0.152: C45.1 117.83,297.79 U100.13 | C33.1 117.81,281.56 U115.13 | C43.1 118,17.64 U108.13 | C40.1 118,56.25 118,54.63 U109.13 | C32.1 118,132.25 118,130.63 U111.13 | C44.1 117.75,149.5 117.75,147.87 U104.13 | C42.1 118,171 118,169.38 U112.13 | C18.1 118,188 118,186.38 U103.13 | C41.1 118,207.75 118,206.13 U113.13 | C37.1 118,223.19 U102.13 | C34.1 118,247 118,245.38 U114.13 | C38.1 117.99,264.5 117.99,262.87 U101.13 | C31.1 117.86,35.77 U107.13 | C39.1 118.3,109.2 117.86,108.77 U105.13 | U106.13 117.85,71.27 C36.1 117.85,73.65 118.1,73.9 v118.5,73.9 | U110.13 117.92,90.56 117.92,91.58 C35.1 | 139.3,281.7 139.2,281.6 | R35.2 147.95,281.35 147.6,281.7 U3.2
  Top 0.254: U100.13 117.86,296.63 v118.25,296.25 | C33.1 118.98,283.48 v119,283.5 123.5,283.5 123.85,283.85 R38.2 | v119,264.5 117.99,264.5 | v119.25,247 118,247 | v119.25,225 118.1,225 C37.1 | v119,207.75 118,207.75 | v119,188 118,188 | v119,171 118,171 | v118.75,149.5 117.75,149.5 | v119,132.25 118,132.25 | v118.5,110.5 118.5,109.4 118.3,109.2 | v118.5,93.25 118.5,92.15 C35.1 | v119,56.25 118,56.25 | v118.5,37.5 118.5,36.4 C31.1 | v119,19.25 118.1,19.25 C43.1
  Top 0.305: R38.2 136.95,283.85 139.2,281.6 | U3.2 139.3,281.7
  Top 0.457: U3.4 139.11,281.6 139.2,281.6
  Bottom 0.254: v118.25,296.25 118.25,290.75 120,289 120,283.7 119.75,283.45 | 119.75,283.45 119.75,265.25 119.4,264.9 | v119,207.75 119.75,208.5 | 119.75,208.5 119.75,224.5 v119.25,225 119.75,225.5 119.75,246.5 v119.25,247 119.91,247.66 119.91,264.39 119.4,264.9 | 119.75,208.5 119.75,188.75 | 119.75,188.75 v119,188 | 119.75,188.75 119.75,171.75 | v119,171 119.75,171.75 | 119.75,171.75 119.75,150.5 | v118.75,149.5 119.75,150.5 | 119.75,150.5 119.75,133 | 119.75,133 v119,132.25 | 119.75,133 119.75,111.75 v118.5,110.5 v118.5,93.25 v118.5,73.9 118.5,59.5 119.75,58.25 119.75,57 | v119,56.25 119.75,57 | 119.75,57 119.75,38.75 v118.5,37.5 119.75,36.25 119.75,20 v119,19.25 | v119,283.5 119.7,283.5 119.75,283.45 | 119.4,264.9 v119,264.5
+12V
  Top 0.152: C10.1 U3.3 145.9,284.06 145.9,285.3 | C7.1 U4.3 167.5,284.04 167.5,285.3
  Top 0.61: J7.1 169.6,296 167.5,293.9 167.5,286.7 | 167.5,286.7 167.5,285.3 | 167.5,286.7 146.4,286.7 145.9,286.2 145.9,285.3
AGND  (via drill 0.35)
  Top 0.406: J8.1 133.75,296 126.55,303.2 98.45,303.2 v96.5,301.25
  pour Route2 (isolate 0.305): 1.75,303.5 1.75,0.75 202,0.75 202,139.25 109,139.25 109,303.5
BT1_0  (via drill 0.35)
  Top 0.152: U100.3 116.5,288.35 116.5,289.75 115.75,290.5 v112,290.5 | v112,263 112.25,262.75 U101.16
  Bottom 0.152: v112,290.5 v112,263
BT2_1  (via drill 0.35)
  Top 0.152: U101.3 116.59,255.16 116,255.75 v112.25,255.75 | v112.5,223.25 112.64,223.11 U102.16
  Bottom 0.152: v112.25,255.75 112.25,223.5 v112.5,223.25
BT3_2  (via drill 0.35)
  Top 0.152: U102.3 116.64,215.61 116.25,216 112.5,216 v112.25,215.75 | v112.25,186.5 113.81,186.5 U103.16
  Bottom 0.152: v112.25,215.75 v112.25,186.5
BT4_3  (via drill 0.35)
  Top 0.152: U103.3 116.59,179.16 116,179.75 v112.25,179.75 | v112.25,148 112.5,147.75 U104.16
  Bottom 0.152: v112.25,179.75 v112.25,148
BT5_4  (via drill 0.35)
  Top 0.152: U104.3 116.59,139.91 115.75,140.75 112.5,140.75 v112.25,140.5 | v112.25,108 112.75,107.5 113.81,107.5 U105.16
  Bottom 0.152: v112.25,140.5 v112.25,108
BT6_5  (via drill 0.35)
  Top 0.152: U105.3 116.59,100.41 116,101 112.5,101 v112.25,100.75 | v112.25,71.5 112.5,71.25 U106.16
  Bottom 0.152: v112.25,100.75 v112.25,71.5
BT7_6  (via drill 0.35)
  Top 0.152: U106.3 116.5,61.84 116.5,63.75 115.5,64.75 v112.25,64.75 | v112.25,35 112.5,34.75 U107.16
  Bottom 0.152: v112.25,64.75 v112.25,35
BT8_7  (via drill 0.35)
  Top 0.152: U108.16 112.75,17.5 v112.5,17.75 | v112.75,27.5 113,27.75 116,27.75 116.59,27.16 U107.3
  Bottom 0.152: v112.5,17.75 112.5,27.25 v112.75,27.5
BT9_8  (via drill 0.35)
  Top 0.152: U109.16 v110.89,54.5 | v110.89,54.5 | v111,10.75 116,10.75 116.75,10 116.75,8.15 U108.3
  Bottom 0.152: v110.89,54.5 110.89,10.86 v111,10.75
BT10_9  (via drill 0.35)
  Top 0.152: U110.16 v111.5,90.5 | v111.5,90.5 | v111.5,47.75 115.75,47.75 116.59,46.91 U109.3
  Bottom 0.152: v111.5,90.5 v111.5,47.75
BT11_10  (via drill 0.35)
  Top 0.152: U111.16 v110.75,130.5 | v110.75,130.5 | v110.75,84 115.75,84 116.75,83 116.75,81.16 U110.3
  Bottom 0.152: v110.75,130.5 v110.75,84
BT12_11  (via drill 0.35)
  Top 0.152: U112.16 112.25,169.25 v111.5,168.5 | v111.5,123.75 115.75,123.75 116.59,122.91 U111.3
  Bottom 0.152: v111.5,168.5 v111.5,123.75
BT13_12  (via drill 0.35)
  Top 0.152: U113.16 v110.5,206 | v110.5,206 | v110.5,162.5 115.75,162.5 116.59,161.66 U112.3
  Bottom 0.152: v110.5,206 v110.5,162.5
BT14_13  (via drill 0.35)
  Top 0.152: U114.16 110.5,245.25 v110.25,245 | v111.5,199.5 115.5,199.5 116.59,198.41 U113.3
  Bottom 0.152: v110.25,245 110.25,238.25 111.5,237 v111.5,199.5
BT15_14  (via drill 0.35)
  Top 0.152: U115.16 113.45,281.5 112.7,282.25 v111.39,282.25 | v111.5,238.25 116,238.25 116.59,237.66 U114.3
  Bottom 0.152: v111.39,282.25 111.39,238.36 v111.5,238.25
D1A  (via drill 0.35)
  Top 0.152: R30.2 137.8,240.8 U34.17 137.8,238 137.8,236.8 137.8,235.7 v138,235.5 | U35.17 160.92,235.83 v161.25,235.5 | U36.17 161.25,214.8 v161.25,217 163.08,218.83 190.58,218.83 192,220.25 192,222.41 U30.17 | v161.25,192.25 161.25,189.9 U37.17 | v161.25,166.5 161.25,164.18 U38.17 | v161.25,210 160.77,210.48 139.27,210.48 137.75,212 137.75,214.41 | 137.75,214.41 U33.17 | 137.75,214.41 137.5,214.66 v137.5,217 | v137.5,192.25 137.5,189.87 U32.17 | v137.5,166.5 137.5,164.15 U31.17
  Bottom 0.152: v161.25,235.5 v161.25,217 v161.25,210 v161.25,192.25 v161.25,166.5 | v137.5,166.5 v137.5,192.25 v137.5,217 137.75,217.25 137.75,230.14 137.64,230.25 137.64,230.75 138,231.11 v138,235.5
D1B  (via drill 0.35)
  Top 0.152: R15.1 139.3,240.8 U34.16 139.3,236.8 139,236.5 v139,235.5 | U35.16 162.42,235.83 v162.75,235.5 | U36.16 162.75,214.8 v162.75,217 164.27,218.52 191.77,218.52 193.42,220.17 U30.16 | v162.75,192.25 162.75,189.9 U37.16 | v162.75,166.5 162.75,164.18 U38.16 | v162.75,210.25 162.22,210.78 140.47,210.78 139.25,212 139.25,214.41 | 139.25,214.41 U33.16 | v139,217 139,214.66 139.25,214.41 | U32.16 139,189.87 v139,192.25 | v138.94,166.5 138.94,165.44 138.75,165.25 138.75,164.4 U31.16
  Bottom 0.152: v162.75,235.5 v162.75,217 v162.75,210.25 v162.75,192.25 v162.75,166.5 | v139,235.5 v139,217 v139,192.25 139,166.56 v138.94,166.5
D1C  (via drill 0.35)
  Top 0.152: R16.1 137.75,227.09 U34.4 138.25,227.59 v138.25,230.5 139.33,231.58 160.34,231.58 v160.64,231.88 | U35.4 160.64,227.41 v160.64,229.75 | U36.4 160.64,203.84 v160.64,206.25 162.5,208.11 191.11,208.11 192,209 192,211.51 U30.4 | v160.64,181.25 160.92,180.98 U37.4 | v160.75,155.5 160.75,153.11 U38.4 | U31.4 137.8,153.3 138.25,153.75 v138.25,155.5 | v138.25,181.25 138.25,179.12 U32.4 | v138.25,206.25 138.25,204.01 U33.4
  Bottom 0.152: v160.75,155.5 160.64,155.61 v160.64,181.25 v160.64,206.25 v160.64,229.75 v160.64,231.88 | v138.25,155.5 v138.25,181.25 v138.25,206.25 v138.25,230.5
D1D  (via drill 0.35)
  Top 0.152: R17.1 134.75,227.09 U34.2 135.25,227.59 v135.25,230.5 136.63,231.88 157.34,231.88 v157.64,232.18 | U35.2 157.64,227.41 v157.64,229.75 | U36.2 157.64,203.84 v157.64,206.25 159.81,208.41 188.41,208.41 189,209 189,211.51 U30.2 | v157.64,181.25 157.92,180.98 U37.2 | v157.75,155.5 157.75,153.11 U38.2 | U33.2 134.8,204.3 135.25,204.75 v135.25,206.25 | v135.25,181.25 135.25,179.12 U32.2 | v135.25,155.5 135.25,153.39 U31.2
  Bottom 0.152: v157.75,155.5 157.64,155.61 v157.64,181.25 v157.64,206.25 v157.64,229.75 v157.64,232.18 | v135.25,230.5 v135.25,206.25 v135.25,181.25 v135.25,155.5
D1DP  (via drill 0.35)
  Top 0.152: R21.1 139.25,227.09 U34.5 139.75,227.59 v139.75,230.5 | v162.14,229.75 162.42,229.48 U35.5 162.25,226.97 | v162.14,181.25 162.42,180.98 U37.5 | v162.25,155.5 162.25,153.11 U38.5 | U31.5 139.3,153.8 139.75,154.25 v139.75,155.5 | v139.75,181.25 139.75,179.12 U32.5 | v139.75,206.25 139.75,204.01 U33.5 139.5,203.37 139.5,201 140.25,200.25 162,200.25 162.42,200.67 U36.5 162.42,205.98 v162.14,206.25 162.14,206.5 163.45,207.81 192.31,207.81 193.5,209 193.5,211.51 U30.5
  Bottom 0.152: v162.14,229.75 v162.14,206.25 v162.14,181.25 162.14,155.61 v162.25,155.5 | v139.75,155.5 v139.75,181.25 v139.75,206.25 v139.75,230.5
D1E  (via drill 0.35)
  Top 0.152: R18.1 133.25,227.09 U34.1 133.75,227.59 v133.75,230.5 135.44,232.19 155.7,232.19 v156,232.49 | U35.1 156,227.56 v156,229.75 | U36.1 156,203.99 v156,206.25 158.5,208.75 187,208.75 187.42,209.17 U30.1 | v156,181.25 156,179.09 U37.1 | v156.25,155.5 156.25,153.11 U38.1 | U33.1 133.3,204.55 133.75,205 v133.75,206.25 | v133.75,181.25 133.75,179.12 U32.1 | v133.75,155.5 133.75,153.39 U31.1
  Bottom 0.152: v156.25,155.5 156,155.75 v156,181.25 v156,206.25 v156,229.75 v156,232.49 | v133.75,230.5 v133.75,206.25 v133.75,181.25 v133.75,155.5
D1F  (via drill 0.35)
  Top 0.152: R19.1 134.8,240.8 U34.19 134.8,237.05 134.5,236.75 v134.5,235.5 | U35.19 157.92,235.83 v158.25,235.5 | U36.19 158.25,214.8 v158.25,217 158.25,217.5 158.79,218.04 161.29,218.04 162.38,219.13 187.88,219.13 188.92,220.17 U30.19 | v158.25,192.25 158.25,189.9 U37.19 | v158.25,166.5 158.25,164.18 U38.19 | v158.25,209.75 157.83,210.17 136.58,210.17 134.75,212 134.75,214.41 U33.19 134.5,214.77 v134.5,217 | v134.5,192.25 134.5,190.25 134.25,190 134.68,189.57 U32.19 | v134.5,166.5 134.5,164.15 U31.19
  Bottom 0.152: v158.25,235.5 v158.25,217 v158.25,209.75 v158.25,192.25 v158.25,166.5 | v134.5,235.5 v134.5,217 v134.5,192.25 v134.5,166.5
D1G  (via drill 0.35)
  Top 0.152: R20.1 133.3,240.8 U34.20 133.3,236.8 133,236.5 v133,235.5 | U35.20 156.42,235.83 v156.75,235.5 | v156.75,217 156.75,214.8 U36.20 | v156.75,192.25 156.75,189.9 U37.20 | v156.75,166.5 156.75,164.18 U38.20 | v156.75,209.5 156.38,209.87 135.38,209.87 133.25,212 133.25,214.41 | 133.25,214.41 U33.20 | v133,217 133,214.66 133.25,214.41 | v133,192.25 133,189.87 U32.20 | v133,166.5 133,165.5 132.75,165.25 132.75,164.4 U31.20 | v156.75,220 157.25,220 157.61,220.36 162.32,220.36 163.25,219.44 186.44,219.44 187.42,220.42 U30.20
  Bottom 0.152: v156.75,235.5 v156.75,220 v156.75,217 v156.75,209.5 v156.75,192.25 v156.75,166.5 | v133,235.5 v133,217 v133,192.25 v133,166.5
D1HI  (via drill 0.35)
  Top 0.152: U21.15 144.11,259.59 v144.15,259.55 | v143.75,170 143.78,169.97 R1.1
  Bottom 0.152: v144.15,259.55 144.15,212.6 144.44,212.31 144.44,201.25 143.75,200.56 v143.75,170
D1PWR  (via drill 0.35)
  Top 0.152: R1.2 143.78,163.87 U31.13 144.25,163.4 v144.25,155.5 144.25,155.25 144.25,154.25 143.8,153.8 U31.8 143.8,151.3 143.25,150.75 136.91,150.75 136.5,151.16 136.5,152.75 U31.3 U31.18
D2A  (via drill 0.35)
  Top 0.152: R29.2 168.5,238.12 U35.12 168.75,237.71 v168.75,235.5 | U36.12 168.75,214.8 v168.75,217 169.39,217 170,217.61 197.11,217.61 199.5,220 199.5,222.41 U30.12 | v168.75,192.25 168.75,189.9 U37.12 | v168.75,166.5 168.75,164.18 U38.12 | v168.75,211.25 168.31,211.69 145.81,211.69 145.25,212.25 145.25,214.25 | 145.25,214.25 145.25,214.41 U33.12 | U34.12 145.3,237.05 145,236.75 v145,235.5 | v145,217 145,214.5 145.25,214.25 | U32.12 145,189.87 v145,192.25 | v145,166.5 145,164.15 U31.12
  Bottom 0.152: v168.75,235.5 v168.75,217 v168.75,211.25 v168.75,192.25 v168.75,166.5 | v145,235.5 v145,217 v145,192.25 v145,166.5
D2B  (via drill 0.35)
  Top 0.152: R22.1 170,238.12 U35.11 170.25,237.71 v170.25,235.5 | v170.5,192.25 170.5,190.15 U37.11 | v170.5,166.5 170.5,164.43 U38.11 | U36.11 169.92,214.72 170.25,215.05 v170.25,217 170.5,217.25 198.25,217.25 200.92,219.92 U30.11 | v170.25,212 147.25,212 146.8,212.45 U33.11 146.5,214.77 v146.5,217 | U34.11 146.8,236.8 146.5,236.5 v146.5,235.5 | v146.5,192.25 146.5,189.87 U32.11 | v146.5,166.5 146.5,164.15 U31.11
  Bottom 0.152: v170.5,166.5 v170.5,192.25 170.25,192.5 v170.25,212 v170.25,217 v170.25,235.5 | v146.5,235.5 v146.5,217 v146.5,192.25 v146.5,166.5
D2C  (via drill 0.35)
  Top 0.152: R23.1 168.5,227.06 U35.9 168.14,227.41 v168.14,229.75 | U36.9 168,203.99 v168,206.25 168,206.5 168.36,206.86 197.36,206.86 199.5,209 199.5,211.51 U30.9 | v168.14,181.25 168.42,180.98 U37.9 | v168.25,155.5 168.25,153.11 U38.9 | v168.14,230.96 167.84,230.66 146.66,230.66 145.75,229.75 145.75,227.59 145.46,227.29 | U34.9 145.46,227.29 | U31.9 145.3,153.8 145.75,154.25 v145.75,155.5 | U32.9 145.32,178.68 145.75,179.12 v145.75,181.5 | v145.75,206.25 145.75,204.01 U33.9 | v145.75,224.5 145.75,227 145.46,227.29
  Bottom 0.152: v168.25,155.5 168.14,155.61 v168.14,181.25 168,181.39 v168,206.25 168.14,206.39 v168.14,229.75 v168.14,230.96 | v145.75,155.5 v145.75,181.5 v145.75,206.25 v145.75,224.5
D2D  (via drill 0.35)
  Top 0.152: R24.1 165.5,227.06 U35.7 165.14,227.41 v165.14,229.75 | U36.7 165.42,205.98 v165.14,206.25 165.14,206.5 165.81,207.16 194.66,207.16 196.5,209 196.5,211.51 U30.7 | v165.14,181.25 165.42,180.98 U37.7 | v165.5,155.5 165.5,153.03 U38.7 | v165.14,231.27 164.84,230.97 143.47,230.97 142.75,230.25 142.75,227.59 U34.7 142.75,226.69 v142.75,224.5 | U31.7 142.3,153.8 142.75,154.25 v142.75,155.5 | v142.75,181.25 142.75,179.12 U32.7 | v142.75,206.25 142.75,204.01 U33.7
  Bottom 0.152: v165.5,155.5 165.14,155.86 v165.14,181.25 v165.14,206.25 v165.14,229.75 v165.14,231.27 | v142.75,155.5 v142.75,181.25 v142.75,206.25 v142.75,224.5
D2DP  (via drill 0.35)
  Top 0.152: R28.1 170,227.06 U35.10 169.64,227.41 v169.64,229.75 169.04,230.36 148.11,230.36 147.3,229.55 147.3,227.64 146.96,227.29 | U36.10 169.92,205.98 v169.64,206.25 198.25,206.25 200.92,208.92 U30.10 | v169.75,181.25 169.75,178.84 U37.10 | v169.75,155.5 169.75,153.11 U38.10 | 146.96,227.29 U34.10 | U31.10 146.8,153.55 147.25,154 v147.25,155.5 | v147.25,181.25 147.25,179.12 U32.10 | v147.25,206.25 147.25,204.01 U33.10 | v147.25,224.5 147.25,227 146.96,227.29
  Bottom 0.152: v169.64,229.75 v169.64,206.25 169.64,181.36 v169.75,181.25 v169.75,155.5 | v147.25,155.5 v147.25,181.25 v147.25,206.25 v147.25,224.5
D2E  (via drill 0.35)
  Top 0.152: R25.1 164,227.06 U35.6 163.92,229.48 v163.64,229.75 | U36.6 163.92,205.98 v163.64,206.25 163.64,206.5 164.64,207.5 193.5,207.5 195,209 195,211.51 U30.6 | v163.64,181.25 163.92,180.98 U37.6 | v163.75,155.5 163.75,153.11 U38.6 | v163.64,231.57 163.34,231.27 142.02,231.27 141.25,230.5 141.25,227.59 U34.6 141.25,226.69 v141.25,224.5 | U31.6 140.8,154.05 141.25,154.5 v141.25,155.5 | v141.25,181.25 141.25,179.12 U32.6 | v141.25,206.25 141.25,204.01 U33.6
  Bottom 0.152: v163.75,155.5 163.64,155.61 v163.64,181.25 v163.64,206.25 v163.64,229.75 v163.64,231.57 | v141.25,155.5 v141.25,181.25 v141.25,206.25 v141.25,224.5
D2F  (via drill 0.35)
  Top 0.152: R26.1 165.5,238.12 U35.14 165.42,235.83 v165.75,235.5 | U36.14 165.75,214.8 v165.75,217 166.66,217.91 194.41,217.91 196.5,220 196.5,222.41 U30.14 | v165.75,192.25 165.75,189.9 U37.14 | v165.75,166.5 165.75,164.18 U38.14 | v165.75,211 165.36,211.39 142.86,211.39 142.25,212 142.25,214.25 | U33.14 142.25,214.41 142.25,214.25 | U34.14 142.3,236.8 142,236.5 v142,235.5 | v142,217 142,214.5 142.25,214.25 | v142,192.25 142,189.87 U32.14 | v142,166.5 142,164.75 141.75,164.5 141.75,164.4 U31.14
  Bottom 0.152: v165.75,235.5 v165.75,217 v165.75,211 v165.75,192.25 v165.75,166.5 | v142,235.5 v142,217 v142,192.25 v142,166.5
D2G  (via drill 0.35)
  Top 0.152: R27.1 164,238.12 U35.15 163.92,235.83 v164.25,235.5 | U36.15 164.25,214.8 v164.25,217 165.47,218.22 193.22,218.22 194.92,219.92 U30.15 | v164.25,192.25 164.25,189.9 U37.15 | v164.25,166.5 164.25,164.18 U38.15 | v164.25,210.75 163.91,211.09 141.66,211.09 140.75,212 140.75,214.41 U33.15 140.5,214.77 v140.5,217 | U34.15 140.8,237.3 140.5,237 v140.5,235.5 | v140.5,192.25 140.5,189.87 U32.15 | v140.5,166.5 140.5,164.15 U31.15
  Bottom 0.152: v164.25,235.5 v164.25,217 v164.25,210.75 v164.25,192.25 v164.25,166.5 | v140.5,235.5 v140.5,217 v140.5,192.25 v140.5,166.5
D2HI  (via drill 0.35)
  Top 0.152: R2.1 143.19,194.5 v131.25,194.5 | U21.1 132.01,260.24 v132,260.25
  Bottom 0.152: v132,260.25 130.25,258.5 130.25,195.5 v131.25,194.5
D2PWR
  Top 0.152: R2.2 143.83,189.6 U32.13 | U32.13 U32.8 143.8,176.8 143,176 137.25,176 136.3,176.95 U32.3 | U32.13 143.8,188.05 142.5,186.75 137.5,186.75 136,188.25 136,189.27 U32.18
D3HI  (via drill 0.35)
  Top 0.152: U21.2 133.09,259.59 v132.75,259.25 | v131,219.25 131.56,218.69 R3.1
  Bottom 0.152: v132.75,259.25 130.75,257.25 130.75,219.5 v131,219.25
D3PWR  (via drill 0.35)
  Top 0.152: R3.2 143.65,214.62 U33.13 143.8,212.05 v143.75,212 | U33.8 143.75,203.62 v143.75,206.25 143,207 137.25,207 v136.3,206.05 U33.3 | v136.25,212 136.25,214.41 U33.18
  Bottom 0.152: v143.75,212 v143.75,206.25 | v136.3,206.05 136.3,211.95 v136.25,212
D4HI  (via drill 0.35)
  Top 0.152: U21.3 136.94,258.94 140.86,262.86 v145.25,262.86 | v145,242.25 144.9,242.15 R5.1
  Bottom 0.152: v145.25,262.86 145.25,242.5 v145,242.25
D4PWR  (via drill 0.35)
  Top 0.152: R5.2 143.8,240.8 U34.13 143.8,236.8 143.5,236.5 v143.5,235.5 142.75,234.75 136.75,234.75 v136,235.5 136,236.5 136.3,236.8 U34.18 | v143.5,229.75 143.5,227.44 U34.8 | v136,229.75 136,227.44 U34.3
  Bottom 0.152: v143.5,235.5 v143.5,229.75 | v136,235.5 v136,229.75
D5HI  (via drill 0.35)
  Top 0.152: U21.4 137.04,258.29 141,262.25 v158.75,262.25 | v159.75,243.5 159.75,242.4 R4.1
  Bottom 0.152: v158.75,262.25 159.75,261.25 v159.75,243.5
D5PWR  (via drill 0.35)
  Top 0.152: R4.2 159.5,238.12 U35.18 159.42,235.58 v159.5,235.5 160.25,234.75 166.25,234.75 v167,235.5 166.92,235.58 U35.13 | v167,229.75 167,227.22 U35.8 | v159.5,229.75 159.5,227.22 U35.3
  Bottom 0.152: v167,235.5 v167,229.75 | v159.5,235.5 v159.5,229.75
D6HI
  Top 0.152: R6.1 145.74,218.76 144.5,220 131.25,220 130,221.25 130,255.75 131.89,257.64 U21.5
D6PWR  (via drill 0.35)
  Top 0.152: R6.2 159.42,217.4 U36.18 159.42,212.64 159.75,212.31 166.1,212.31 166.5,212.71 166.5,214.05 U36.13 166.92,216.92 v167,217 | v167,206.25 167,203.65 | 167,203.65 U36.8 | U36.3 159.5,203.49 v159.5,201 | v159.5,199.25 166.5,199.25 167,199.75 167,203.65
  Bottom 0.152: v167,217 v167,206.25 | v159.5,201 v159.5,199.25
D7HI  (via drill 0.35)
  Top 0.152: U21.6 135.87,256.99 v136.05,256.8 | v146.36,253.5 145.86,254 136.25,254 v136,254.25 | v151.36,194 159.45,194 R7.1
  Bottom 0.152: v136.05,256.8 136.05,254.3 v136,254.25 | v146.36,253.5 146.36,244.57 150.56,240.38 150.56,194.8 v151.36,194
D7PWR
  Top 0.152: R7.2 159.53,189.68 U37.18 159.25,189.4 159.25,188.25 160.75,186.75 165.75,186.75 166.92,187.92 U37.13 U37.8 166.92,177.17 165.5,175.75 160.5,175.75 159.25,177 159.25,178.5 U37.3
D8HI  (via drill 0.35)
  Top 0.152: R8.1 150.03,168.03 v150,168 | v145.86,254.75 145.36,255.25 136.75,255.25 135.66,256.34 U21.7
  Bottom 0.152: v150,168 150,240.25 145.75,244.5 145.75,254.75 v145.86,254.75
D8PWR
  Top 0.152: R8.2 159.48,163.91 U38.18 U38.3 159.42,150.83 160,150.25 166.5,150.25 167,150.75 167,151.5 166.92,151.58 U38.8 U38.13
DISP_CLK  (via drill 0.35)
  Top 0.152: U20.11 150.53,252.17 v150.36,252 | v150.5,243 150.5,244.35 | 150.5,244.35 U23.11 | U22.11 140.15,246.3 150,246.3 150.5,245.8 150.5,244.35 | U21.11 143.1,256.99 v143.11,257 | v150.36,252 144.36,252 v143.11,253.25 | v178,263.75 178.25,264 U1.19 | v175.25,252 175,251.75 150.61,251.75 v150.36,252
  Bottom 0.152: v150.36,252 150.5,251.86 v150.5,243 | v143.11,257 v143.11,253.25 | v178,263.75 177.8,263.55 177.8,254.55 v175.25,252
DISP_SER  (via drill 0.35)
  Top 0.152: v175.25,263.75 177,265.5 U1.22 | U20.14 152.47,256.23 152.64,256.39 167.11,256.39 171.25,252.25 174,252.25 174.25,252.5 v174.25,255.25
  Bottom 0.152: v174.25,255.25 175.25,256.25 v175.25,263.75
DISP_STRB  (via drill 0.35)
  Top 0.152: U20.12 151.18,256.48 v151.16,256.5 | v151.41,243 151.18,243.23 U23.12 | v151.16,256.5 150.91,256.5 149.77,257.64 v141.75,257.64 U21.12 | U22.12 141.46,246.93 v141.5,246.97 | v176.18,263.75 176.23,263.75 177.48,265 U1.21 | v151.16,256.5 151.5,256.5 152,257 167.5,257 170.25,254.25 v173.25,254.25
  Bottom 0.152: v151.41,243 151.16,243.25 151.16,246.07 v151.16,256.5 | v141.5,246.97 141.5,257.39 v141.75,257.64 | v176.18,263.75 176.18,263.5 176.68,263 176.68,256.68 174.25,254.25 v173.25,254.25
DISP_~OE  (via drill 0.35)
  Top 0.152: v151.82,253.28 U20.13 151.82,256.27 152.25,256.69 167.31,256.69 171,253 v173.25,253 | U23.13 151.77,244.44 v151.77,246 150.19,247.57 v142.25,247.57 U22.13 | v142.5,258.25 140.47,258.25 U21.13 | U1.20 177.84,264.5 v177.09,263.75
  Bottom 0.152: v142.25,247.57 142.5,247.82 v142.5,258.25 | v177.09,263.75 177.2,263.64 177.2,255.7 174.5,253 v173.25,253 | v151.77,246 151.77,253.22 v151.82,253.28
DISP_~SRCLR  (via drill 0.35)
  Top 0.152: U20.10 149.88,256.07 v150,256.19 140.58,256.19 U21.10 | U23.10 149.75,244.5 v149.75,245.69 140.19,245.69 U22.10 | U1.23 176.5,266 174.34,263.84 v174.34,263.75 | v152.38,257.63 167.37,257.63 169.75,255.25 172.61,255.25 v173.11,255.75
  Bottom 0.152: v149.75,245.69 149.75,255.94 v150,256.19 150,256.25 151.38,257.63 v152.38,257.63 | v174.34,263.75 174.34,257.09 173,255.75 v173.11,255.75
DRIV_CLK  (via drill 0.35)
  Top 0.152: U100.2 115.33,289.57 v115.5,289.75 | U115.2 115.5,272.18 v115.5,274.25 115.96,274.25 116.11,274.11 153.14,274.11 162.75,264.5 U1.61 | v115.5,254.75 115.5,253.43 U101.2 | v115.5,237.25 115.5,235.93 U114.2 | v115.5,215 115.5,213.74 U102.2 | v115.5,198 115.5,196.68 U113.2 | v115.5,178.25 115.5,176.93 U103.2 | v115.5,161.25 115.5,159.93 U112.2 | v115.5,139.75 115.5,138.43 U104.2 | v115.5,122.5 115.5,121.17 U111.2 | v115.5,99.75 115.5,98.42 U105.2 | v115.5,82.5 115.5,81.17 U110.2 | v115.5,63.25 115.5,61.92 U106.2 | v115.5,46.5 115.5,45.17 U109.2 | v115.5,26.75 115.5,25.43 U107.2 | v115.5,9.5 115.5,8.18 U108.2 | U1.61
  Bottom 0.152: v115.5,289.75 v115.5,274.25 v115.5,254.75 v115.5,237.25 v115.5,215 v115.5,198 v115.5,178.25 v115.5,161.25 v115.5,139.75 v115.5,122.5 v115.5,99.75 v115.5,82.5 v115.5,63.25 v115.5,46.5 v115.5,26.75 v115.5,9.5
DRIV_DATA  (via drill 0.35)
  Top 0.152: U115.3 116.14,272.45 v116.14,273.5 | v116.14,268 156.5,268 161.5,263 U1.64
  Bottom 0.152: v116.14,273.5 v116.14,268
DRIV_EN  (via drill 0.35)
  Top 0.152: U100.14 116.59,296.4 v116.75,296.25 | v116.5,278.75 116.5,281.4 U115.14 | v116.5,261.25 116.59,261.35 U101.14 | v116.5,243.75 116.5,245.16 U114.14 | v116.5,221.5 116.5,222.97 U102.14 | v116.5,204.5 116.5,205.91 U113.14 | v116.5,184.75 116.5,186.16 U103.14 | v116.5,167.75 116.5,169.16 U112.14 | v116.5,146.25 116.5,147.66 U104.14 | v116.5,129 116.5,130.41 U111.14 | v116.5,106.25 116.5,107.66 U105.14 | v116.5,89 116.5,90.41 U110.14 | v116.5,69.75 116.5,71.16 U106.14 | v116.5,53 116.5,54.41 U109.14 | v116.5,33.25 116.5,34.66 U107.14 | v116.5,16 116.5,17.41 U108.14 | v116.75,269 v155,269 | v162,264.25 162.25,264 U1.62
  Bottom 0.152: v116.75,296.25 116.75,279 v116.5,278.75 116.75,278.5 v116.75,269 116.75,261.5 v116.5,261.25 116.75,261 116.75,244 v116.5,243.75 116.75,243.5 116.75,221.75 v116.5,221.5 116.75,221.25 116.75,204.75 v116.5,204.5 116.75,204.25 116.75,185 v116.5,184.75 116.75,184.5 116.75,168 v116.5,167.75 116.75,167.5 116.75,146.5 v116.5,146.25 116.75,146 116.75,129.25 v116.5,129 116.75,128.75 116.75,106.5 v116.5,106.25 116.75,106 116.75,89.25 v116.5,89 116.75,88.75 116.75,70 v116.5,69.75 116.75,69.5 116.75,53.25 v116.5,53 116.75,52.75 116.75,33.5 v116.5,33.25 116.75,33 116.75,16.25 v116.5,16 | v155,269 159.75,264.25 v162,264.25
DRIV_STRB  (via drill 0.35)
  Top 0.152: U100.4 117.86,289.63 v117.75,289.75 | U115.4 117.75,272.12 v117.75,273.5 151.75,273.5 161.75,263.5 U1.63 | v117.75,254.75 117.75,253.37 U101.4 | v117.75,237.25 117.75,235.87 U114.4 | v117.75,215 117.75,213.77 U102.4 | v117.75,198 117.75,196.62 U113.4 | v117.75,178.25 117.75,176.87 U103.4 | v117.75,161.25 117.75,159.87 U112.4 | v117.75,139.75 117.75,138.37 U104.4 | v117.75,122.5 117.75,121.11 U111.4 | v117.75,99.75 117.75,98.36 U105.4 | v117.75,82.5 117.75,81.11 U110.4 | v117.75,63.25 117.75,61.87 U106.4 | v117.75,46.5 117.75,45.12 U109.4 | v117.75,26.75 117.75,25.36 U107.4 | v117.75,9.5 117.75,8.12 U108.4
  Bottom 0.152: v117.75,289.75 v117.75,273.5 v117.75,254.75 v117.75,237.25 v117.75,215 v117.75,198 v117.75,178.25 v117.75,161.25 v117.75,139.75 v117.75,122.5 v117.75,99.75 v117.75,82.5 v117.75,63.25 v117.75,46.5 v117.75,26.75 v117.75,9.5
GND  (via drill 0.35)
  Top 0.152: K64.8 v26.25,7.75 | K71.8 v36.99,7.75 v37,7.75 | K65.8 v47.74,7.75 v47.75,7.75 | K70.8 v58.49,7.75 v58.5,7.75 | K66.8 v69.25,7.75 | K69.8 v80,7.75 | K67.8 v90.75,7.75 | K68.8 v101.5,7.75 | K60.8 101.44,24.94 v101.5,25 | K59.8 90.69,24.94 v90.75,25 | K61.8 79.94,24.94 v80,25 | K58.8 69.19,24.94 v69.25,25 | K62.8 58.44,24.94 v58.5,25 | K57.8 47.69,24.94 v47.75,25 | K63.8 37.19,24.94 v37.25,25 | K56.8 26.44,24.94 v26.5,25 | K72.8 26.15,44.65 v26.25,44.75 | K79.8 36.9,44.65 v37,44.75 | K73.8 47.4,44.65 v47.5,44.75 | K78.8 58.4,44.65 v58.5,44.75 | K74.8 69.15,44.65 v69.25,44.75 | K77.8 79.9,44.65 v80,44.75 | K75.8 90.65,44.65 v90.75,44.75 | K76.8 101.15,44.65 v101.25,44.75 | K48.8 26.16,61.59 v26.25,61.5 | K55.8 36.91,61.59 v37,61.5 | K49.8 47.66,61.59 v47.75,61.5 | K54.8 58.41,61.59 v58.5,61.5 | K50.8 69.16,61.59 v69.25,61.5 | K53.8 79.91,61.59 v80,61.5 | K51.8 90.66,61.59 v90.75,61.5 | K52.8 101.41,61.59 v101.5,61.5 | K80.8 26.2,80.8 v26.25,80.75 | K87.8 36.95,80.8 v37,80.75 | K81.8 47.7,80.8 v47.75,80.75 | K86.8 58.45,80.8 v58.5,80.75 | K82.8 69.2,80.8 v69.25,80.75 | K85.8 79.95,80.8 v80,80.75 | K83.8 90.7,80.8 v90.75,80.75 | K84.8 101.45,80.8 v101.5,80.75 | K44.8 101.41,97.66 v101.5,97.75 | K43.8 90.66,97.66 v90.75,97.75 | K45.8 79.91,97.66 v80,97.75 | K42.8 68.91,97.66 v69,97.75 | K46.8 58.41,97.66 v58.5,97.75 | K41.8 47.66,97.66 v47.75,97.75 | K47.8 36.91,97.66 v37,97.75 | K40.8 26.16,97.66 v26.25,97.75 | K88.8 26.35,121.35 v26.5,121.5 | K95.8 37.1,121.35 v37.25,121.5 | K89.8 47.6,121.35 v47.75,121.5 | K94.8 58.35,121.35 v58.5,121.5 | K90.8 69.1,121.35 v69.25,121.5 | K93.8 79.85,121.35 v80,121.5 | K91.8 90.6,121.35 v90.75,121.5 | K92.8 101.35,121.35 v101.5,121.5
  Top 0.152: K36.8 101.36,137.86 v101.5,138 | K35.8 90.61,137.86 v90.75,138 | K37.8 79.86,137.86 v80,138 | K34.8 69.11,137.86 v69.25,138 | K38.8 58.36,137.86 v58.5,138 | K33.8 47.61,137.86 v47.75,138 | K39.8 36.86,137.86 v37,138 | K32.8 26.11,137.86 v26.25,138 | K96.8 26.4,159.65 v26.5,159.75 | K103.8 37.15,159.65 v37.25,159.75 | K97.8 47.65,159.65 v47.75,159.75 | K102.8 58.4,159.65 v58.5,159.75 | K98.8 69.15,159.65 v69.25,159.75 | K101.8 79.9,159.65 v80,159.75 | K99.8 90.65,159.65 v90.75,159.75 | K100.8 101.4,159.65 v101.5,159.75 | K28.8 101.69,176.31 v101.75,176.25 | K27.8 90.69,176.31 v90.75,176.25 | K29.8 79.94,176.31 v80,176.25 | K26.8 69.19,176.31 v69.25,176.25 | K30.8 58.44,176.31 v58.5,176.25 | K25.8 47.69,176.31 v47.75,176.25 | K31.8 36.69,176.31 v36.75,176.25 | K24.8 26.19,176.31 v26.25,176.25 | K104.8 25.97,196.47 v26,196.5 | K111.8 36.97,196.47 v37,196.5 | K105.8 47.72,196.47 v47.75,196.5 | K110.8 58.47,196.47 v58.5,196.5 | K106.8 69.22,196.47 v69.25,196.5 | K109.8 79.97,196.47 v80,196.5 | K107.8 90.47,196.47 v90.5,196.5 | K108.8 101.22,196.47 v101.25,196.5 | K20.8 101.1,212.9 v101.25,212.75 | K19.8 90.6,212.9 v90.75,212.75 | K21.8 80.1,212.9 v80.25,212.75 | K18.8 69.1,212.9 v69.25,212.75 | K22.8 58.35,212.9 v58.5,212.75 | K17.8 47.6,212.9 v47.75,212.75 | K23.8 36.85,212.9 v37,212.75 | K16.8 26.1,212.9 v26.25,212.75 | K112.8 v26.24,235.49 v26.25,235.5 | K119.8 v36.74,235.49 v36.75,235.5 | K113.8 v47.49,235.49 v47.5,235.5 | K118.8 v58.24,235.49 v58.25,235.5 | K114.8 v68.99,235.49 v69,235.5 | K117.8 v79.49,235.49 v79.5,235.5 | K115.8 v90.49,235.49 v90.5,235.5 | K116.8 v101.49,235.49 v101.5,235.5 | K12.8 v101.5,253 | K11.8 v90.75,253
  Top 0.152: K13.8 v80,253 | K10.8 v69.25,253 | K14.8 v58.5,253 | K9.8 v47.75,253 | K15.8 v37,253 | K8.8 v26,253 | K120.8 25.91,272.59 v26,272.5 | K127.8 36.66,272.59 v36.75,272.5 | K121.8 47.41,272.59 v47.5,272.5 | K126.8 58.16,272.59 v58.25,272.5 | K122.8 68.91,272.59 v69,272.5 | K125.8 79.66,272.59 v79.75,272.5 | K123.8 90.41,272.59 v90.5,272.5 | K124.8 101.16,272.59 v101.25,272.5 | K4.8 101.15,288.1 v101.25,288 | K3.8 90.4,288.1 v90.5,288 | K5.8 79.4,288.1 v79.5,288 | K2.8 68.9,288.1 v69,288 | K6.8 58.15,288.1 v58.25,288 | K1.8 47.4,288.1 v47.5,288 | K7.8 36.59,288.16 v36.75,288 | K0.8 26.21,288.04 v26.25,288 | U100.1 | U100.1 v113,288.25 | C25.2 115.27,301 v114,301 | C45.2 118.97,301.03 v119,301 | C17.2 115.21,284.75 v114,284.75 | C33.2 118.97,284.78 v119,284.75 | U115.1 | U115.1 v113,272 | C23.2 115.1,265.75 v114,265.75 | C38.2 118.85,265.9 v119,265.75 | U101.1 | U101.1 v113,253.25 | C19.2 114.1,248.4 v114,248.5 | C34.2 118.1,248.5 v119.25,248.5 | U114.1 | U114.1 v113,235.75 | v114,226.5 115.15,226.5 C22.2 | v119,226.5 118.9,226.4 C37.2 | U102.1 114,213.5 v113,213.5 | C29.2 115.1,209 v114,209 | C41.2 118.85,209.15 v119,209 | U113.1 | U113.1 v113,196.5 | C14.2 114.1,189.4 v114,189.5 | C18.2 118.9,189.4 v119,189.5 | U103.1 | U103.1 v113,176.75 | U112.1 | U112.1 v113,159.75 | C26.2 114.1,150.9 v114,151 | C44.2 118.65,150.9 v118.75,151 | U104.1 | U104.1 v113,138.25 | C16.2 114.1,133.65 v114,133.75 | C32.2 118.9,133.65 v119,133.75 | U111.1 | U111.1 v113,121 | C24.2 113.5,109.35 v113.5,110.5 | C39.2 119.65,110.4 v119.75,110.5 | U105.1 | U105.1 v113,98.25 | v113.75,93.25 113.85,93.15 C20.2 | v119.75,93.25 119.75,92.1 C35.2 | U110.1 | U110.1 v113,81 | U106.1 | U106.1 v113,61.75 | v114,57.75 115.15,57.75 C30.2
  Top 0.152: C40.2 118.9,57.65 v119,57.75 | U109.1 | U109.1 v113,45 | v113.5,37.5 113.6,37.4 C15.2 | v119.75,37.5 119.75,36.35 C31.2 | U107.1 | U107.1 v113.25,25.25 | C27.2 115.1,20.5 v114,20.5 | C43.2 118.85,20.65 v119,20.5 | U108.1 | U108.1 v113,8 | C104.2 169.65,257.1 169.12,257.62 | 169.12,257.62 v168.5,258.25 | C103.2 170.97,257.62 169.12,257.62 | C106.2 173.4,257.1 v173.25,257.25 | C105.2 171.85,275.65 v171.75,275.75 | C13.2 176.41,275.66 v176.5,275.75 | v176,259.5 175.75,259.75 U1.12 | U1.27 v177.75,268 | U1.35 v176.75,274 | v175,270.25 174.75,270.5 U1.39 | X1.B1/A12 195.25,255.75 v195,256 | R10.1 193.5,251 | 190.75,249.37 U2.2 190.74,248.22 U2.25 | C28.2 114.1,172.4 v114,172.5 | C42.2 118.1,172.5 v119,172.5 | v134.5,254.75 134.5,255.5 U21.8 | v134.25,244 134.25,244.85 U22.8 | U23.8 149.1,250 v148.25,250 | U20.8 148.38,260.62 v148.25,260.75 | C4.2 156.4,255.4 v156.5,255.5 | C2.2 143.4,250.65 v143.5,250.75 | C3.2 156.5,244.15 v156.5,243 | C1.2 v144.5,260.5 | C21.2 v113.6,73.8 | C36.2 119.15,73.75 119.3,73.9 v119.8,73.9 | U1.3
  other vias: 184.6,266.8 164.05,268.55 192.6,254.5 186.25,253 192.7,251 195.25,248.85 163.95,267.35 185.3,264.9 183.7,269 191.3,250.4 150.8,282.5 152.2,284 172.6,282.5 174,284 172.7,277.5 151.1,278.4 155,277.2 156.2,277.2 134.5,277.2 133.3,277.2 184.2,248.2 191.3,258.4
  pour Route15 (isolate 0.305): 1.5,303.75 1.5,0.75 202,0.75 202,303.75
  pour Top: 110.2,303.3 201.8,303.3 201.8,145 110.2,145
HI_OUT  (via drill 0.35)
  Top 0.152: U21.9 139.31,255.69 v139,256 | v138.75,248.25 140.1,248.25 U22.14
  Bottom 0.152: v139,256 139,248.5 v138.75,248.25
IN0
  Top 0.254: 41,299 33,299 30.87,296.87 K0.4 27.21,292 23,292 X101.2 | K7.4 41.6,298.4 41,299 | 41,299 51.5,299 | K1.4 52.14,298.36 51.5,299 | 51.5,299 62,299 | 62,299 63,298 63,295.85 K6.4 | 62,299 73,299 | K2.4 73.61,298.39 73,299 | 73,299 84,299 | 84,299 84.5,298.5 84.5,295.88 K5.4 | 84,299 94.5,299 | K3.4 95.07,298.43 94.5,299 | 94.5,299 105,299 105.8,298.2 K4.4
IN1
  Top 0.254: 39.5,264.25 33.5,264.25 31,261.75 31,260.94 K8.4 30.68,259.12 28.3,256.75 20.68,256.75 18.29,254.36 18.29,247.96 16.29,245.96 X102.2 | 39.5,264.25 41.5,262.25 41.5,260.71 K15.4 | 39.5,264.25 50,264.25 | K9.4 52.14,262.11 50,264.25 | 50,264.25 61,264.25 | 61,264.25 63,262.25 63,260.75 K14.4 | 61,264.25 71.5,264.25 | K10.4 73.61,262.14 71.5,264.25 | 71.5,264.25 82.5,264.25 | 82.5,264.25 84.5,262.25 84.5,260.79 K13.4 | 82.5,264.25 93,264.25 | K11.4 95.07,262.18 93,264.25 | 93,264.25 104,264.25 106,262.25 106,260.82 K12.4
IN2
  Top 0.254: 39.5,223.75 33,223.75 30.68,221.43 K16.4 30.68,218.92 27.76,216 23,216 X103.2 | K23.4 41.5,220.61 41.5,221.75 39.5,223.75 | 39.5,223.75 50,223.75 | K17.4 52.14,221.61 50,223.75 | 50,223.75 61,223.75 | 61,223.75 63,221.75 63,220.65 K22.4 | 61,223.75 71.5,223.75 | K18.4 73.61,221.64 71.5,223.75 | 71.5,223.75 82.5,223.75 | 82.5,223.75 84.5,221.75 84.5,220.69 K21.4 | 82.5,223.75 93,223.75 | K19.4 95.07,221.68 93,223.75 | 93,223.75 104,223.75 106,221.75 106,220.72 K20.4
IN3